# Altium project MDES_V3.PrjPCB
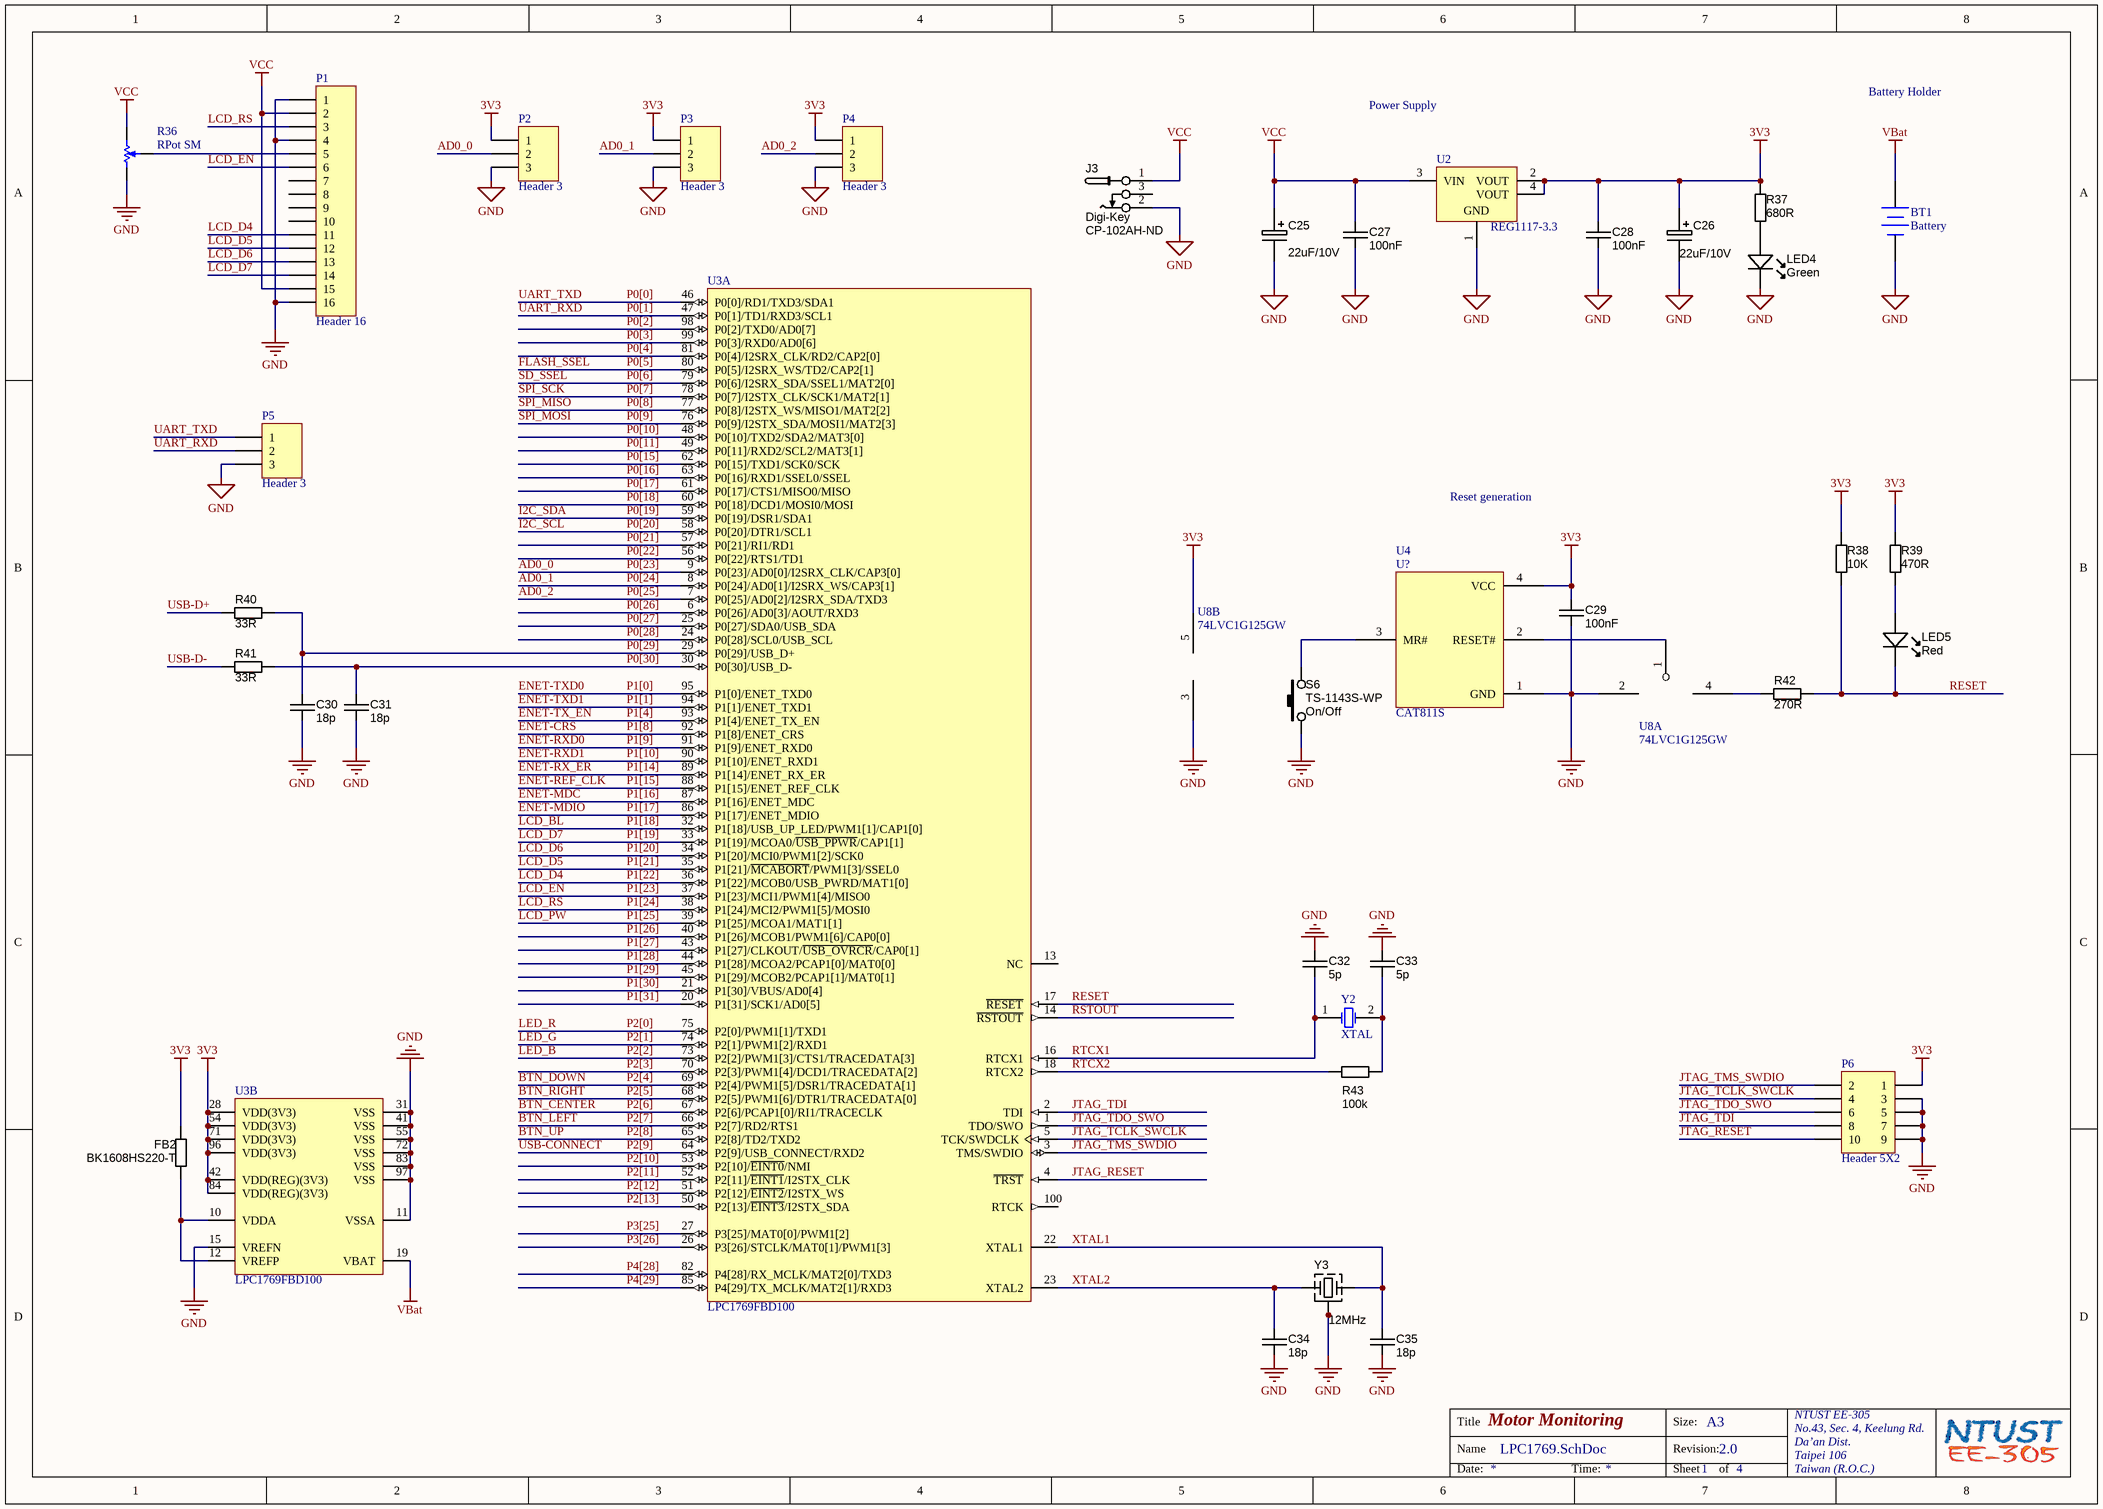
[diagram p0: LPC1769.SchDoc]
9 sheets, 227 parts. Net scope: global (net labels, ports and power ports of the same name join across sheets).
Board file: MDES_V3.PcbDoc
Sheets:
  LPC1769.SchDoc
  Ethernet.SchDoc
  Debug and Reset.SchDoc
  Power supply.SchDoc
  SPI peripherals.SchDoc
  USB.SchDoc
  Analog Input.SchDoc
  Expansion connectors.SchDoc
  Accelerometer.SchDoc

## Sheet LPC1769.SchDoc: Motor Monitoring
size A3; Organization: NTUST EE-305; Address1: No.43, Sec. 4, Keelung Rd.; Address2: Da’an Dist.; Address3: Taipei 106; Address4: Taiwan (R.O.C.); Revision: 2.0; SheetNumber: 1; SheetTotal: 4

### Parts
(Parts that share a designator on the sheet are numbered #1, #2 ... from top to bottom, then left to right.)
BT1  Battery  [BAT-2]
C25#1  (no value)  [CAP_ELEC_5x5.7]
C26#1  (no value)  [CAP_ELEC_5x5.7]
C27#1  value 100nF  [CAPC1608N]  (hidden comment: approved sub OK)
C28#1  value 100nF  [CAPC1608N]  (hidden comment: approved sub OK)
C29#1  value 100nF  [CAPC1005N]  (hidden comment: approved sub OK)
C30#1  value 18p  [CAPC1608N]  (hidden comment: approved sub OK)
C31#1  value 18p  [CAPC1608N]  (hidden comment: approved sub OK)
C32#1  value 5p  [CAPC1005N]  (hidden comment: approved sub OK)
C33#1  value 5p  [CAPC1005N]  (hidden comment: approved sub OK)
C34#1  value 18p  [CAPC1005N]  (hidden comment: approved sub OK)
C35#1  value 18p  [CAPC1005N]  (hidden comment: approved sub OK)
FB2  value BK1608HS220-T  [RESC2012N]  (hidden comment: Thick Film)
J3#1  Supplier 1: Digi-Key  Supplier Part Number 1: CP-102AH-ND  [CONN_PWR_JACK_2.1x5.5mm]  (hidden comment: CONN_PWR_JACK_2.1x5.5mm)
LED4  Green  [LED-0603-GREEN]
LED5  Red  [LED-0603-GREEN]
P1#1  Header 16  [HDR1X16]
P2#1  Header 3  [HDR1X3]
P3#1  Header 3  [HDR1X3]
P4#1  Header 3  [HDR1X3]
P5  Header 3  [HDR1X3]
P6  Header 5X2  [Header 5x2p]
R36  RPot SM  [POT4MM-2]
R37  value 680R  [RESC1005N]  (hidden comment: Thick Film)
R38  value 10K  [RESC1005N]  (hidden comment: Thick Film)
R39  value 470R  [RESC1005N]  (hidden comment: Thick Film)
R40  value 33R  [RESC1608N]  (hidden comment: Thick Film)
R41  value 33R  [RESC1608N]  (hidden comment: Thick Film)
R42  value 270R  [RESC1005N]  (hidden comment: Thick Film)
R43  value 100k  [RESC1005N]  (hidden comment: Thick Film)
S6  TS-1143S-WP  Function: On/Off  [TS-1143S]
U2#1  REG1117-3.3  [TI-DCY4_N]
U3#1  LPC1769FBD100  [SOT407-1_V]  (parts A,B of 2)
U4#1  CAT811S  [SOT-143-RC4_N]
U8#1  74LVC1G125GW  [SOT-23-CT5_N]  (parts A,B of 2)
Y2  XTAL  [HC49/4H_SMX]
Y3#1  12MHz  [CRYSTAL_4-LCC]

### Nets
3V3: C26#1.1 C28#1.2 C29#1.1 FB2.2 P2#1.1 P3#1.1 P4#1.1 P6.1 R37.2 R38.2 R39.2 U2#1.2(VOUT) U2#1.4(VOUT) U3#1.28(VDD(3V3)) U3#1.42(VDD(REG)(3V3)) U3#1.54(VDD(3V3)) U3#1.71(VDD(3V3)) U3#1.84(VDD(REG)(3V3)) U3#1.96(VDD(3V3)) U4#1.4(VCC) U8#1.5(VCC)
GND: BT1.2(-) C25#1.2 C26#1.2 C27#1.2 C28#1.1 C29#1.2 C30#1.1 C31#1.1 C32#1.2 C33#1.2 C34#1.1 C35#1.1 J3#1.2 LED4.K P1#1.1 P1#1.4 P1#1.16 P2#1.3 P3#1.3 P4#1.3 P5.3 P6.3 P6.5 P6.7 P6.9 R36.CCW(-) S6.1 U2#1.1(GND) U3#1.11(VSSA) U3#1.15(VREFN) U3#1.31(VSS) U3#1.41(VSS) U3#1.55(VSS) U3#1.72(VSS) U3#1.83(VSS) U3#1.97(VSS) U4#1.1(GND) U8#1.2(A) U8#1.3(GND) Y3#1.2(GND) Y3#1.4(GND)
VBAT: BT1.1(+) U3#1.19(VBAT)
VCC: C25#1.1 C27#1.1 J3#1.1 P1#1.2 P1#1.15 R36.CW(+) U2#1.3(VIN)
AD0_0: P2#1.2 U3#1.9(P0[23]/AD0[0]/I2SRX_CLK/CAP3[0])  [also labelled P0[23]]
AD0_1: P3#1.2 U3#1.8(P0[24]/AD0[1]/I2SRX_WS/CAP3[1])  [also labelled P0[24]]
AD0_2: P4#1.2 U3#1.7(P0[25]/AD0[2]/I2SRX_SDA/TXD3)  [also labelled P0[25]]
BTN_CENTER: U3#1.67(P2[6]/PCAP1[0]/RI1/TRACECLK)  [also labelled P2[6]]
BTN_DOWN: U3#1.69(P2[4]/PWM1[5]/DSR1/TRACEDATA[1])  [also labelled P2[4]]
BTN_LEFT: U3#1.66(P2[7]/RD2/RTS1)  [also labelled P2[7]]
BTN_RIGHT: U3#1.68(P2[5]/PWM1[6]/DTR1/TRACEDATA[0])  [also labelled P2[5]]
BTN_UP: U3#1.65(P2[8]/TD2/TXD2)  [also labelled P2[8]]
ENET-CRS: U3#1.92(P1[8]/ENET_CRS)  [also labelled P1[8]]
ENET-MDC: U3#1.87(P1[16]/ENET_MDC)  [also labelled P1[16]]
ENET-MDIO: U3#1.86(P1[17]/ENET_MDIO)  [also labelled P1[17]]
ENET-REF_CLK: U3#1.88(P1[15]/ENET_REF_CLK)  [also labelled P1[15]]
ENET-RX_ER: U3#1.89(P1[14]/ENET_RX_ER)  [also labelled P1[14]]
ENET-RXD0: U3#1.91(P1[9]/ENET_RXD0)  [also labelled P1[9]]
ENET-RXD1: U3#1.90(P1[10]/ENET_RXD1)  [also labelled P1[10]]
ENET-TX_EN: U3#1.93(P1[4]/ENET_TX_EN)  [also labelled P1[4]]
ENET-TXD0: U3#1.95(P1[0]/ENET_TXD0)  [also labelled P1[0]]
ENET-TXD1: U3#1.94(P1[1]/ENET_TXD1)  [also labelled P1[1]]
FLASH_SSEL: U3#1.80(P0[5]/I2SRX_WS/TD2/CAP2[1])  [also labelled P0[5]]
I2C_SCL: U3#1.58(P0[20]/DTR1/SCL1)  [also labelled P0[20]]
I2C_SDA: U3#1.59(P0[19]/DSR1/SDA1)  [also labelled P0[19]]
JTAG_RESET: P6.10 U3#1.4(~{TRST})
JTAG_TCLK_SWCLK: P6.4 U3#1.5(TCK/SWDCLK)
JTAG_TDI: P6.8 U3#1.2(TDI)
JTAG_TDO_SWO: P6.6 U3#1.1(TDO/SWO)
JTAG_TMS_SWDIO: P6.2 U3#1.3(TMS/SWDIO)
LCD_BL: U3#1.32(P1[18]/USB_UP_LED/PWM1[1]/CAP1[0])  [also labelled P1[18]]
LCD_D4: P1#1.11 U3#1.36(P1[22]/MCOB0/USB_PWRD/MAT1[0])  [also labelled P1[22]]
LCD_D5: P1#1.12 U3#1.35(P1[21]/~{MCABORT}/PWM1[3]/SSEL0)  [also labelled P1[21]]
LCD_D6: P1#1.13 U3#1.34(P1[20]/MCI0/PWM1[2]/SCK0)  [also labelled P1[20]]
LCD_D7: P1#1.14 U3#1.33(P1[19]/MCOA0/~{USB_PPWR}/CAP1[1])  [also labelled P1[19]]
LCD_EN: P1#1.6 U3#1.37(P1[23]/MCI1/PWM1[4]/MISO0)  [also labelled P1[23]]
LCD_PW: U3#1.39(P1[25]/MCOA1/MAT1[1])  [also labelled P1[25]]
LCD_RS: P1#1.3 U3#1.38(P1[24]/MCI2/PWM1[5]/MOSI0)  [also labelled P1[24]]
LED_B: U3#1.73(P2[2]/PWM1[3]/CTS1/TRACEDATA[3])  [also labelled P2[2]]
LED_G: U3#1.74(P2[1]/PWM1[2]/RXD1)  [also labelled P2[1]]
LED_R: U3#1.75(P2[0]/PWM1[1]/TXD1)  [also labelled P2[0]]
P0[0]: P5.1 U3#1.46(P0[0]/RD1/TXD3/SDA1)  [also labelled UART_TXD]
P0[1]: P5.2 U3#1.47(P0[1]/TD1/RXD3/SCL1)  [also labelled UART_RXD]
P0[2]: U3#1.98(P0[2]/TXD0/AD0[7])
P0[3]: U3#1.99(P0[3]/RXD0/AD0[6])
P0[4]: U3#1.81(P0[4]/I2SRX_CLK/RD2/CAP2[0])
P0[6]: U3#1.79(P0[6]/I2SRX_SDA/SSEL1/MAT2[0])  [also labelled SD_SSEL]
P0[7]: U3#1.78(P0[7]/I2STX_CLK/SCK1/MAT2[1])  [also labelled SPI_SCK]
P0[8]: U3#1.77(P0[8]/I2STX_WS/MISO1/MAT2[2])  [also labelled SPI_MISO]
P0[9]: U3#1.76(P0[9]/I2STX_SDA/MOSI1/MAT2[3])  [also labelled SPI_MOSI]
P0[10]: U3#1.48(P0[10]/TXD2/SDA2/MAT3[0])
P0[11]: U3#1.49(P0[11]/RXD2/SCL2/MAT3[1])
P0[15]: U3#1.62(P0[15]/TXD1/SCK0/SCK)
P0[16]: U3#1.63(P0[16]/RXD1/SSEL0/SSEL)
P0[17]: U3#1.61(P0[17]/CTS1/MISO0/MISO)
P0[18]: U3#1.60(P0[18]/DCD1/MOSI0/MOSI)
P0[21]: U3#1.57(P0[21]/RI1/RD1)
P0[22]: U3#1.56(P0[22]/RTS1/TD1)
P0[26]: U3#1.6(P0[26]/AD0[3]/AOUT/RXD3)
P0[27]: U3#1.25(P0[27]/SDA0/USB_SDA)
P0[28]: U3#1.24(P0[28]/SCL0/USB_SCL)
P0[29]: C30#1.2 R40.1 U3#1.29(P0[29]/USB_D+)
P0[30]: C31#1.2 R41.1 U3#1.30(P0[30]/USB_D-)
P1[26]: U3#1.40(P1[26]/MCOB1/PWM1[6]/CAP0[0])
P1[27]: U3#1.43(P1[27]/CLKOUT/~{USB_OVRCR}/CAP0[1])
P1[28]: U3#1.44(P1[28]/MCOA2/PCAP1[0]/MAT0[0])
P1[29]: U3#1.45(P1[29]/MCOB2/PCAP1[1]/MAT0[1])
P1[30]: U3#1.21(P1[30]/VBUS/AD0[4])
P1[31]: U3#1.20(P1[31]/SCK1/AD0[5])
P2[3]: U3#1.70(P2[3]/PWM1[4]/DCD1/TRACEDATA[2])
P2[9]: U3#1.64(P2[9]/USB_CONNECT/RXD2)  [also labelled USB-CONNECT]
P2[10]: U3#1.53(P2[10]/~{EINT0}/NMI)
P2[11]: U3#1.52(P2[11]/~{EINT1}/I2STX_CLK)
P2[12]: U3#1.51(P2[12]/~{EINT2}/I2STX_WS)
P2[13]: U3#1.50(P2[13]/~{EINT3}/I2STX_SDA)
P3[25]: U3#1.27(P3[25]/MAT0[0]/PWM1[2])
P3[26]: U3#1.26(P3[26]/STCLK/MAT0[1]/PWM1[3])
P4[28]: U3#1.82(P4[28]/RX_MCLK/MAT2[0]/TXD3)
P4[29]: U3#1.85(P4[29]/TX_MCLK/MAT2[1]/RXD3)
RESET: LED5.K R38.1 R42.1 U3#1.17(~{RESET})
RSTOUT: U3#1.14(~{RSTOUT})
RTCX1: C32#1.1 U3#1.16(RTCX1) Y2.1(OSC1)
RTCX2: R43.2 U3#1.18(RTCX2)
USB-D+: R40.2
USB-D-: R41.2
XTAL1: C35#1.2 U3#1.22(XTAL1) Y3#1.3(X)
XTAL2: C34#1.2 U3#1.23(XTAL2) Y3#1.1(X)
NetC33#1_1: C33#1.1 R43.1 Y2.2(OSC2)
NetFB2_1: FB2.1 U3#1.10(VDDA) U3#1.12(VREFP)
NetLED4_A: LED4.A R37.1
NetLED5_A: LED5.A R39.1
NetP1#1_5: P1#1.5 R36.W
NetR42_2: R42.2 U8#1.4(Y)
NetS6_2: S6.2 U4#1.3(MR#)
NetU4#1_2: U4#1.2(RESET#) U8#1.1(~{OE})

Not connected (* = marked no-connect by the designer): J3#1 3; P1#1 7 8 9 10; U3#1 13(NC) 100(RTCK)

### Notes on the sheet
- Power Supply
- Battery Holder
- Reset generation
- Title
- Name
- Size:
- Revision:
- A3
- Date:
- Time:
- Sheet
- of
- (in symbol CAPT_100u_1210_6V3) 22uF/10V
- (in symbol CAT811S) U?

### Library data of the parts
BT1 = Battery: Multicell Battery; Published: 24-Mar-1999; LatestRevisionDate: 17-Jul-2002; LatestRevisionNote: Re-released for DXP Platform.; PackageReference: BAT-2; Publisher: Altium Limited; PackageDescription: Battery; 2 Leads
C25#1 C26#1 = CAPT_100u_1210_6V3: Capacitor SMD Tantalum 100uF 20% 6.3V 1210; Manufacturer 1: AVX Corporation; Manufacturer Part Number 1: TCJB107M006R0045; Tolerance: ?0%; Package / Case: 1210 (3528 Metric); Material: Tantalum; Supplier 1: Digi-Key; Supplier Part Number 1: 478-4711-1-ND
C27#1 C28#1 C29#1 C30#1 C31#1 C32#1 C33#1 C34#1 C35#1 = CAPC_100n_0805: Capacitor SMD Cer 100nF 10% 50V X7R 0805; Manufacturer 1: Kemet; Manufacturer Part Number 1: C0805C104K5RACTU; Tolerance: ?0%; Ratings: 50V; X7R; Material: ceramic; Package / Case: 0805 (2012 metric); Supplier 1: Digi-Key; Supplier Part Number 1: 399-1170-1-ND
FB2 R38 R40 R41 R43 = RES_10K_0805_5%: Resistor SMD chip 10k Ohm 0.125W 5% 0805; Manufacturer 1: Yageo; Manufacturer Part Number 1: RC0805JR-0710KL; Ratings: 1/8 W; Tolerance: ?%; Package / Case: 0805 (2012 metric); Material: Thick Film; Supplier 1: Digi-Key; Supplier Part Number 1: 311-10KARCT-ND
J3#1 = CONN_PWR_JACK_2.1x5.5mm: Power Connector, THT, 2.1mm ID, 5.5mm OD; Manufacturer 1: CUI Inc; Manufacturer Part Number 1: PJ-102AH; Category: Connectors; Mounting Type: Through Hole; Package / Case: PCB mount; Value: 2.1mm ID, 5.5mm OD
LED4 = LED_SMD_Green_0805_8mcd: LED, 0805 SMD, Green; Manufacturer 1: Ligitek; Manufacturer Part Number 1: LG-170PG-CT; Material: GaP; Ratings: 8 mcd; 558 nm; Package / Case: 0805
LED5 = LED_SMD_Red_0805: LED, 0805 SMD, Red; Manufacturer 1: Ligitek; Manufacturer Part Number 1: LG170SR-CT; Material: GaAIAs; Ratings: 20 mcd; 643 nm; Package / Case: 0805
P1#1 = Header 16: Header, 16-Pin; LatestRevisionDate: 17-Jul-2002; LatestRevisionNote: Re-released for DXP Platform.; Publisher: Altium Limited
P2#1 P3#1 P4#1 P5 = Header 3: Header, 3-Pin; LatestRevisionDate: 17-Jul-2002; LatestRevisionNote: Re-released for DXP Platform.; Publisher: Altium Limited
P6 = Header 5X2: Header, 5-Pin, Dual row; LatestRevisionDate: 17-Jul-2002; LatestRevisionNote: Re-released for DXP Platform.; Publisher: Altium Limited
R36 = RPot SM: Square Trimming Potentiometer; Published: 17-Dec-2003; DatasheetVersion: Oct-2003; PackageReference: POT4MM-2; Publisher: Altium Limited; PackageDescription: Square Trimming Potentiometer; ComponentLink1Description: Manufacturer Link; ComponentLink1URL: http://bourns.com/2/search.html
R37 R42 = RES_330R_0402_5%: Resistor SMD chip 330 Ohm 0.063W 5% 0402; Manufacturer 1: Yageo; Manufacturer Part Number 1: RC0402JR-07330RL; Ratings: 1/16 W; Tolerance: ?%; Package / Case: 0402 (1005 Metric); Supplier 1: Digi-Key; Supplier Part Number 1: 311-330JRCT-ND; ComponentLink1URL: http://www.yageo.com/documents/recent/PYu-RC0402_51_RoHS_L_6.pdf; ComponentLink1Description: http://www.yageo.com/documents/recent/PYu-RC0402_51_RoHS_L_6.pdf
R39 = RES_470R_0603_5%: Resistor SMD chip 470 Ohm 0.1W 5% 0603; Manufacturer 1: Vishay/Dale; Manufacturer Part Number 1: CRCW0603470RJNEA; Ratings: 1/10 W; Tolerance: ?%; Package / Case: 0603 (1608 metric); Material: Thick Film; Supplier 1: Digi-Key; Supplier Part Number 1: 541-470GCT-ND
S6 = SW_SMD_PB_4.3mm: Switch SMD Tact 4.3mm Stem; Manufacturer 1: Bond-Tact; Manufacturer Part Number 1: TS-1143S-WP-200; Package / Case: 6.5x6.5mm; 4.3mm stem
U2#1 = REG1117-3.3: Single Output LDO, 800 mA, Fixed 3.3 V Output, 3.8 to 15 V Input, with Internal Current Limiting, 4-pin SOT-223 (DCY), -40 to 125 degC, Green (RoHS & no Sb/Br); Manufacturer: Texas Instruments; Fixed Output Options(V): 5; Iout(Max)(A): 0.8; Iq(Typ)(mA): 4; Rating: Catalog; SubFamily: Single Channel LDO; Vdo(Typ)(mV): 1100; Vin(Max)(V): 15; Vin(Min)(V): 3.8; Vout Adj(Max)(V): 3.3; DatasheetVersion: SBVS001D; PackageVersion: 4202506/B; PackageReference: DCY4; PackageDescription: 4-Pin Plastic Small Outline, Body 3.5 x 6.5 mm, Pitch 2.3 mm; Supplier 1: Digi-Key; Supplier Part Number 1: REG1117-3.3-ND; Supplier 2: Farnell; Supplier Part Number 2: 1212355; Supplier 3: Farnell; Supplier Part Number 3: 2126471; Supplier 4: Newark; Supplier Part Number 4: 35C1963; Supplier 5: Mouser; Supplier Part Number 5: 595-REG1117-3.3; Eco-Plan: Green (RoHS & no Sb/Br); Vout Adj(Min)(V): 3.3; Mounting Technology: Surface Mount; Code_JEDEC: TO-261; PartNumber: REG1117-3.3; ComponentLink1Description: Manufacturer URL; ComponentLink1URL: http://www.ti.com/; ComponentLink2Description: Datasheet; ComponentLink2URL: http://www.ti.com/general/docs/lit/getliterature.tsp?genericPartNumber=REG1117-33&fileType=pdf; ComponentLink3Description: Package Specification; ComponentLink3URL: http://www.ti.com/litv/pdf/mpds094a
U3#1 = LPC1769FBD100: 32-bit ARM Cortex-M3 MCU, 512 kB Flash, 64 kB SRAM, Ethernet, USB 2.0 Device/Host/OTG, 12-Bit ADC, DAC, I2S, 100-Pin LQFP; fmax: 120 MHz; SRAM: 64 kB; Flash: 512 kB; GPIOs: 70; USB: 1; CAN: 2; UART: 4; PWM: 6; PLL: Y; ADC channels: 8; VDD (min): 2.4 V; VDD (typ): 3.3 V; VDD (max): 3.6 V; Code_IEC: 136E20; DatasheetVersion: Rev. 8, Nov-2011; PackageVersion: Feb-2003; PackageReference: SOT407-1; PackageDescription: LQFP100: Plastic Low Profile Quad Flat Package; 100 Leads; Body 14 x 14 x 1.4 mm; SPI: 1; SSP: 2; Timers: 4; Code_JEDEC: MS-026; PartNumber: LPC1769FBD100; ComponentLink1Description: Manufacturer URL; ComponentLink1URL: http://www.nxp.com/; ComponentLink2Description: Datasheet; ComponentLink2URL: http://www.nxp.com/documents/data_sheet/LPC1769_68_67_66_65_64_63.pdf
Y2 = XTAL: Crystal Oscillator; Published: 8-Jun-2000; LatestRevisionDate: 17-Jul-2002; LatestRevisionNote: Re-released for DXP Platform.; PackageReference: R38; Publisher: Altium Limited; PackageDescription: Crystal, Thru-Hole; 2 Leads; Body 3.1 x 8.2 mm (Dia.xH)
Y3#1 = CRYSTAL_27M12: Oscillator Crystal 27.12 MHz 10ppm; Manufacturer 1: TXC CORPORATION; Manufacturer Part Number 1: 7M-27.120MEEQ-T; Ratings: 4.9152 MHz Crystal; Frequency Stability: ?0ppm; Load Capacitance: 10pF; Operating Mode: Fundamental; Package / Case: 2.5mm pitch; Material: Ceramic; Supplier 1: Digi-Key; Supplier Part Number 1: 887-1329-1-ND; Type: MHz Crystal; Frequency Tolerance: ?0ppm; Operating Temperature: -20蚓 ~ 70蚓; Mounting Type: Surface Mount; Size / Dimension: 0.126" L x 0.098" W (3.20mm x 2.50mm); ComponentLink1URL: http://www.txccrystal.com/images/pdf/7m-accuracy.pdf; ComponentLink1Description: http://www.txccrystal.com/images/pdf/7m-accuracy.pdf

## Sheet Ethernet.SchDoc: Motor Vibration
size A4; Organization: NTUST EE-305; Address1: No.43, Sec. 4, Keelung Rd.; Address2: Da’an Dist.; Address3: Taipei 106; Address4: Taiwan (R.O.C.); DocumentNumber: 1; Revision: 3.0; SheetNumber: 2; SheetTotal: 9
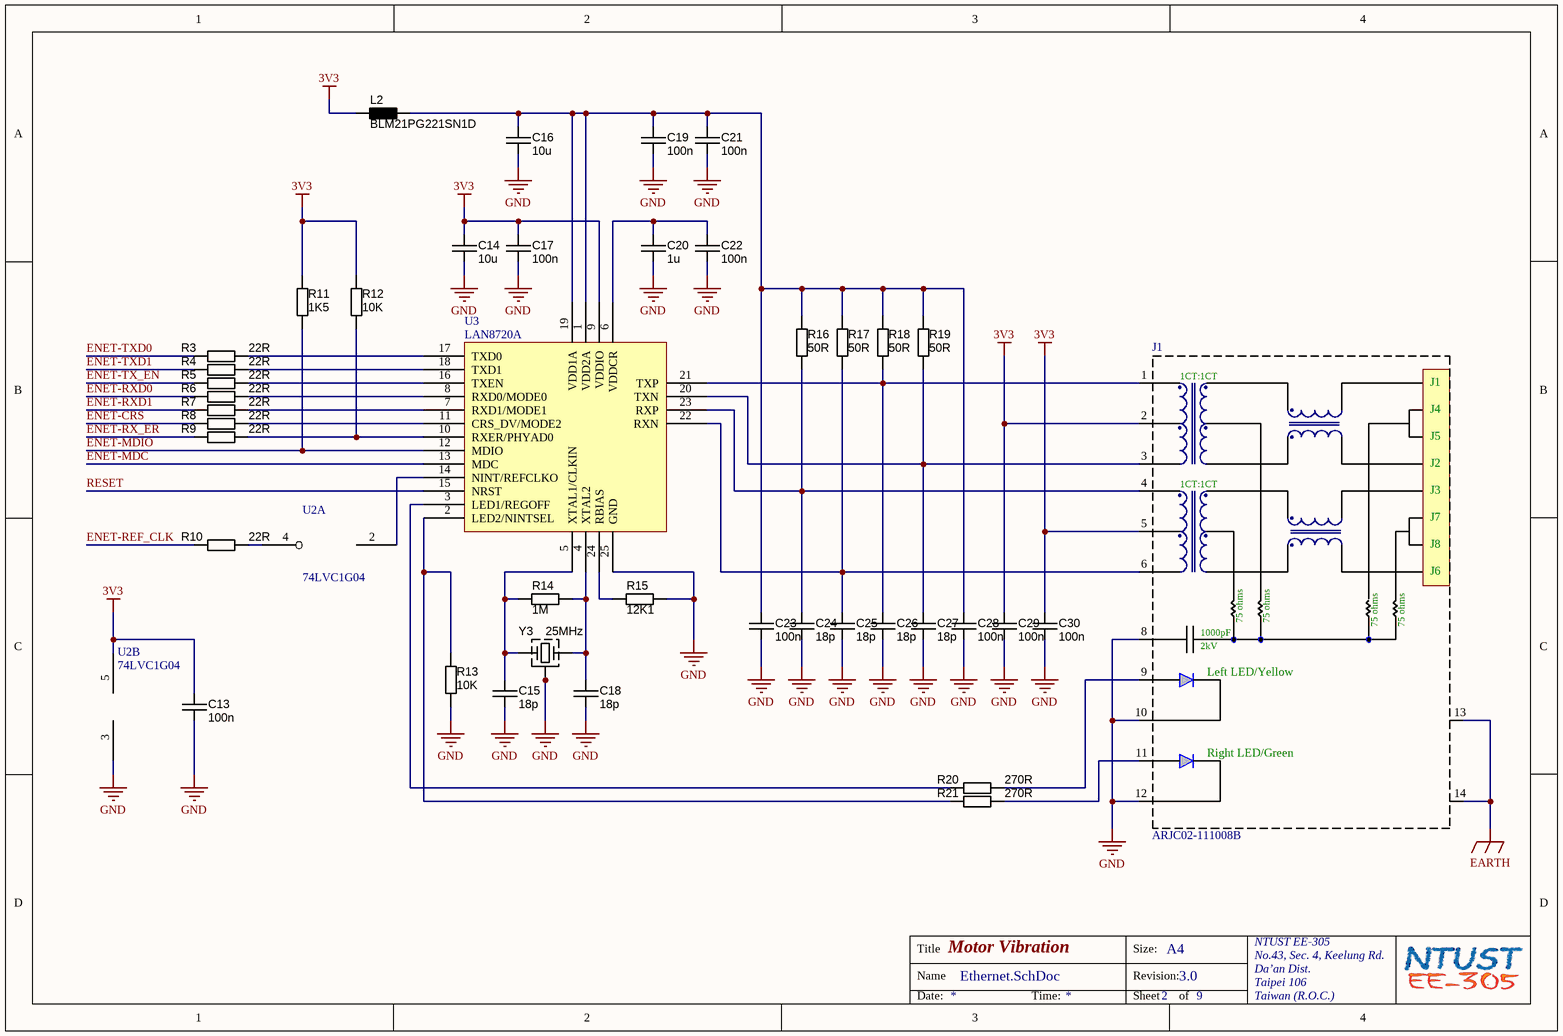
[diagram p1: Ethernet.SchDoc]

### Parts
(Parts that share a designator on the sheet are numbered #1, #2 ... from top to bottom, then left to right.)
C13  100n  [CAPC1005N]
C14  10u  [CAPC2012N]
C15  18p  [CAPC1005N]
C16  10u  [CAPC2012N]
C17  100n  [CAPC1005N]
C18  18p  [CAPC1005N]
C19  100n  [CAPC1005N]
C20  1u  [CAPC1608N]
C21  100n  [CAPC1005N]
C22  100n  [CAPC1005N]
C23  100n  [CAPC1005N]
C24  18p  [CAPC1005N]
C25#2  18p  [CAPC1005N]
C26#2  18p  [CAPC1005N]
C27#2  18p  [CAPC1005N]
C28#2  100n  [CAPC1005N]
C29#2  100n  [CAPC1005N]
C30#2  100n  [CAPC1005N]
J1  ARJC02-111008B  [ARJC02-111008B]
L2  BLM21PG221SN1D  [INDC2012N]
R3  22R  [RESC1005N]
R4  22R  [RESC1005N]
R5  22R  [RESC1005N]
R6  22R  [RESC1005N]
R7  22R  [RESC1005N]
R8  22R  [RESC1005N]
R9  22R  [RESC1005N]
R10  22R  [RESC1005N]
R11  1K5  [RESC1005N]
R12  10K  [RESC1005N]
R13  10K  [RESC1005N]
R14  1M  [RESC1005N]
R15  12K1  [RESC1005N]
R16  50R  [RESC1005N]
R17  50R  [RESC1005N]
R18  50R  [RESC1005N]
R19  50R  [RESC1005N]
R20  270R  [RESC1005N]
R21  270R  [RESC1005N]
U2#2  74LVC1G04  [SC70-LT5_N]  (parts A,B of 2)
U3#2  LAN8720A  [QFN-MJ24]
Y3#2  25MHz  [4SMD]

### Nets
3V3: C13.1 C14.1 C17.1 C29#2.1 C30#2.1 J1.2(CTD) J1.5(CRD) L2.1 R11.1 R12.1 U2#2.5(VCC) U3#2.9(VDDIO)
EARTH: J1.13(GND) J1.14(GND)
GND: C13.2 C14.2 C15.2 C16.2 C17.2 C18.2 C19.2 C20.2 C21.2 C22.2 C23.2 C24.2 C25#2.2 C26#2.2 C27#2.2 C28#2.2 C29#2.2 C30#2.2 J1.8(Shield) J1.10 J1.12 R13.2 R15.2 U2#2.3(GND) U3#2.25(GND) Y3#2.2(GND) Y3#2.4(GND)
ENET-CRS: R8.1
ENET-MDC: U3#2.13(MDC)
ENET-MDIO: R11.2 U3#2.12(MDIO)
ENET-REF_CLK: R10.1
ENET-RX_ER: R9.1
ENET-RXD0: R6.1
ENET-RXD1: R7.1
ENET-TX_EN: R5.1
ENET-TXD0: R3.1
ENET-TXD1: R4.1
RESET: U3#2.15(NRST)
NetC15_1: C15.1 R14.1 U3#2.5(XTAL1/CLKIN) Y3#2.1(X)
NetC16_1: C16.1 C19.1 C21.1 C23.1 C28#2.1 L2.2 R16.1 R17.1 R18.1 R19.1 U3#2.1(VDD2A) U3#2.19(VDD1A)
NetC18_1: C18.1 R14.2 U3#2.4(XTAL2) Y3#2.3(X)
NetC20_1: C20.1 C22.1 U3#2.6(VDDCR)
NetC24_1: C24.1 J1.4(RD+) R16.2 U3#2.23(RXP)
NetC25#2_1: C25#2.1 J1.6(RD-) R17.2 U3#2.22(RXN)
NetC26#2_1: C26#2.1 J1.1(TD+) R18.2 U3#2.21(TXP)
NetC27#2_1: C27#2.1 J1.3(TD-) R19.2 U3#2.20(TXN)
NetJ1_9: J1.9 R20.2
NetJ1_11: J1.11 R21.2
NetR3_2: R3.2 U3#2.17(TXD0)
NetR4_2: R4.2 U3#2.18(TXD1)
NetR5_2: R5.2 U3#2.16(TXEN)
NetR6_2: R6.2 U3#2.8(RXD0/MODE0)
NetR7_2: R7.2 U3#2.7(RXD1/MODE1)
NetR8_2: R8.2 U3#2.11(CRS_DV/MODE2)
NetR9_2: R9.2 R12.2 U3#2.10(RXER/PHYAD0)
NetR10_2: R10.2 U2#2.4
NetR13_1: R13.1 R21.1 U3#2.2(LED2/NINTSEL)
NetR15_1: R15.1 U3#2.24(RBIAS)
NetR20_1: R20.1 U3#2.3(LED1/REGOFF)
NetU2#2_2: U2#2.2 U3#2.14(NINT/REFCLKO)

### Notes on the sheet
- Title
- Name
- Size:
- Revision:
- A4
- Date:
- Time:
- Sheet
- of
- (in symbol ARJC02-111008B) 1CT:1CT; J4; J5; J2; J3; J7; J8; J6; 75 ohms; 1000pF; 2kV; Left LED/Yellow; Right LED/Green

### Library data of the parts
C13 C14 C16 C17 C19-C23 C28#2 C29#2 C30#2 = Capacitor SMD Cer X7R: Manufacturer 1: Kemet; Manufacturer Part Number 1: C0805C104K5RACTU; Tolerance: ?0%; Ratings: 50V; X7R; Material: ceramic; Package / Case: 0805 (2012 metric); Supplier 1: Digi-Key; Supplier Part Number 1: 399-1170-1-ND
  C13 C17 C19 C21-C23 C28#2 C29#2 C30#2: Value: 100n
  C14 C16: Value: 10u
  C20: Value: 1u
C15 C18 C24 C25#2 C26#2 C27#2 = Capacitor SMD Cer NPO: Manufacturer 1: Kemet; Manufacturer Part Number 1: C0805C104K5RACTU; Tolerance: ?0%; Ratings: 50V; X7R; Material: ceramic; Package / Case: 0805 (2012 metric); Supplier 1: Digi-Key; Supplier Part Number 1: 399-1170-1-ND; Value: 18p
J1 = ARJC02-111008B: 1 Port RJ45 Magjack Connector Through Hole 10/100 Base-TX, AutoMDIX; Supplier 1: Digi-Key; Supplier Part Number 1: 535-12605-ND
L2 = BLM21PG221SN1D: EMIFILr (Inductor type) Chip Ferrite Bead; Supplier 1: Digi-Key; Supplier Part Number 1: 490-1054-1-ND
R3-R21 = Resistor SMD chip: Manufacturer 1: Yageo; Manufacturer Part Number 1: RC0805JR-0710KL; Ratings: 1/8 W; Tolerance: ?%; Package / Case: 0805 (2012 metric); Material: Thick Film; Supplier 1: Digi-Key; Supplier Part Number 1: 311-10KARCT-ND
  R3-R10: Value: 22R
  R11: Value: 1K5
  R12 R13: Value: 10K
  R14: Value: 1M
  R15: Value: 12K1
  R16-R19: Value: 50R
  R20 R21: Value: 270R
U3#2 = Microchip LAN8720A: Small Footprint RMII 10/100 Ethernet  Transceiver with HP Auto-MDIX Support; Supplier 1: Digi-Key; Supplier Part Number 1: LAN8720A-CP-CT-ND
Y3#2 = CRYSTAL 25M: Oscillator Crystal; Supplier 1: Digi-Key; Supplier Part Number 1: 887-1099-1-ND

## Sheet Debug and Reset.SchDoc: Motor Vibration
size A4; Organization: NTUST EE-305; Address1: No.43, Sec. 4, Keelung Rd.; Address2: Da’an Dist.; Address3: Taipei 106; Address4: Taiwan (R.O.C.); DocumentNumber: 1; Revision: 3.0; SheetNumber: 3; SheetTotal: 9
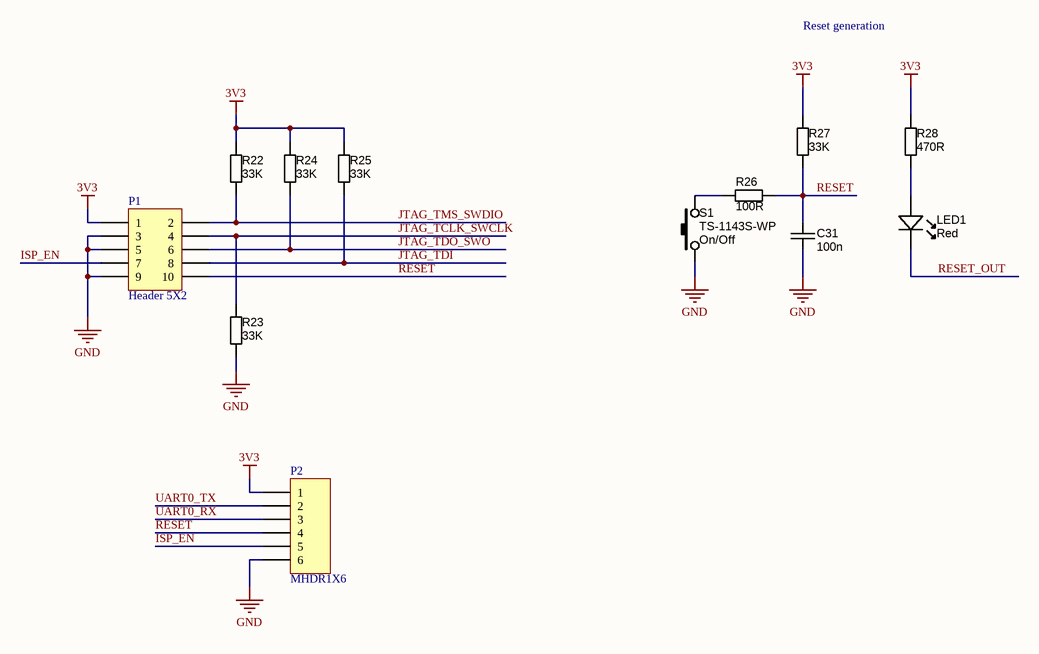
[diagram p2: Debug and Reset.SchDoc]

### Parts
(Parts that share a designator on the sheet are numbered #1, #2 ... from top to bottom, then left to right.)
C31#2  100n  [CAPC1005N]
LED1  Red  [LED-0603-RED]
P1#2  Header 5X2  [Header 5x2 1.27mm]
P2#2  MHDR1X6  [MHDR1X6]
R22  33K  [RESC1005N]
R23  33K  [RESC1005N]
R24  33K  [RESC1005N]
R25  33K  [RESC1005N]
R26  100R  [RESC1005N]
R27  33K  [RESC1005N]
R28  470R  [RESC1005N]
S1  TS-1143S-WP  Function: On/Off  [TS-1143S]

### Nets
3V3: P1#2.1 P2#2.1 R22.1 R24.1 R25.1 R27.1 R28.1
GND: C31#2.2 P1#2.3 P1#2.5 P1#2.9 P2#2.6 R23.2 S1.1
ISP_EN: P1#2.7 P2#2.5
JTAG_TCLK_SWCLK: P1#2.4 R23.1
JTAG_TDI: P1#2.8 R25.2
JTAG_TDO_SWO: P1#2.6 R24.2
JTAG_TMS_SWDIO: P1#2.2 R22.2
RESET: C31#2.1 P1#2.10 P2#2.4 R26.2 R27.2
RESET_OUT: LED1.K
UART0_RX: P2#2.3
UART0_TX: P2#2.2
NetLED1_A: LED1.A R28.2
NetR26_1: R26.1 S1.2

### Notes on the sheet
- Reset generation
- Title
- Name
- Size:
- Revision:
- A4
- Date:
- Time:
- Sheet
- of

### Library data of the parts
C31#2 = Capacitor SMD Cer X7R: as C13 on sheet Ethernet; Package / Case: 0805 (2012 metric); Supplier 1: Digi-Key; Supplier Part Number 1: 399-1170-1-ND; Value: 100n
LED1 = LED_SMD_Red_0805: as LED5 on sheet LPC1769; Package / Case: 0805
P1#2 = Header 5X2: Header, 5-Pin, Dual row; LatestRevisionDate: 17-Jul-2002; LatestRevisionNote: Re-released for DXP Platform.; Publisher: Altium Limited
P2#2 = MHDR1X6: Header, 6-Pin; LatestRevisionDate: 17-Jul-2002; LatestRevisionNote: Re-released for DXP Platform.; Publisher: Altium Limited
R22-R28 = Resistor SMD chip: as R3 on sheet Ethernet; Package / Case: 0805 (2012 metric); Material: Thick Film; Supplier 1: Digi-Key; Supplier Part Number 1: 311-10KARCT-ND
  R22-R25 R27: Value: 33K
  R26: Value: 100R
  R28: Value: 470R
S1 = SW_SMD_PB_4.3mm: as S6 on sheet LPC1769; Package / Case: 6.5x6.5mm; 4.3mm stem

## Sheet Power supply.SchDoc: Motor Vibration
size A4; Organization: NTUST EE-305; Address1: No.43, Sec. 4, Keelung Rd.; Address2: Da’an Dist.; Address3: Taipei 106; Address4: Taiwan (R.O.C.); DocumentNumber: 1; Revision: 3.0; SheetNumber: 4; SheetTotal: 9
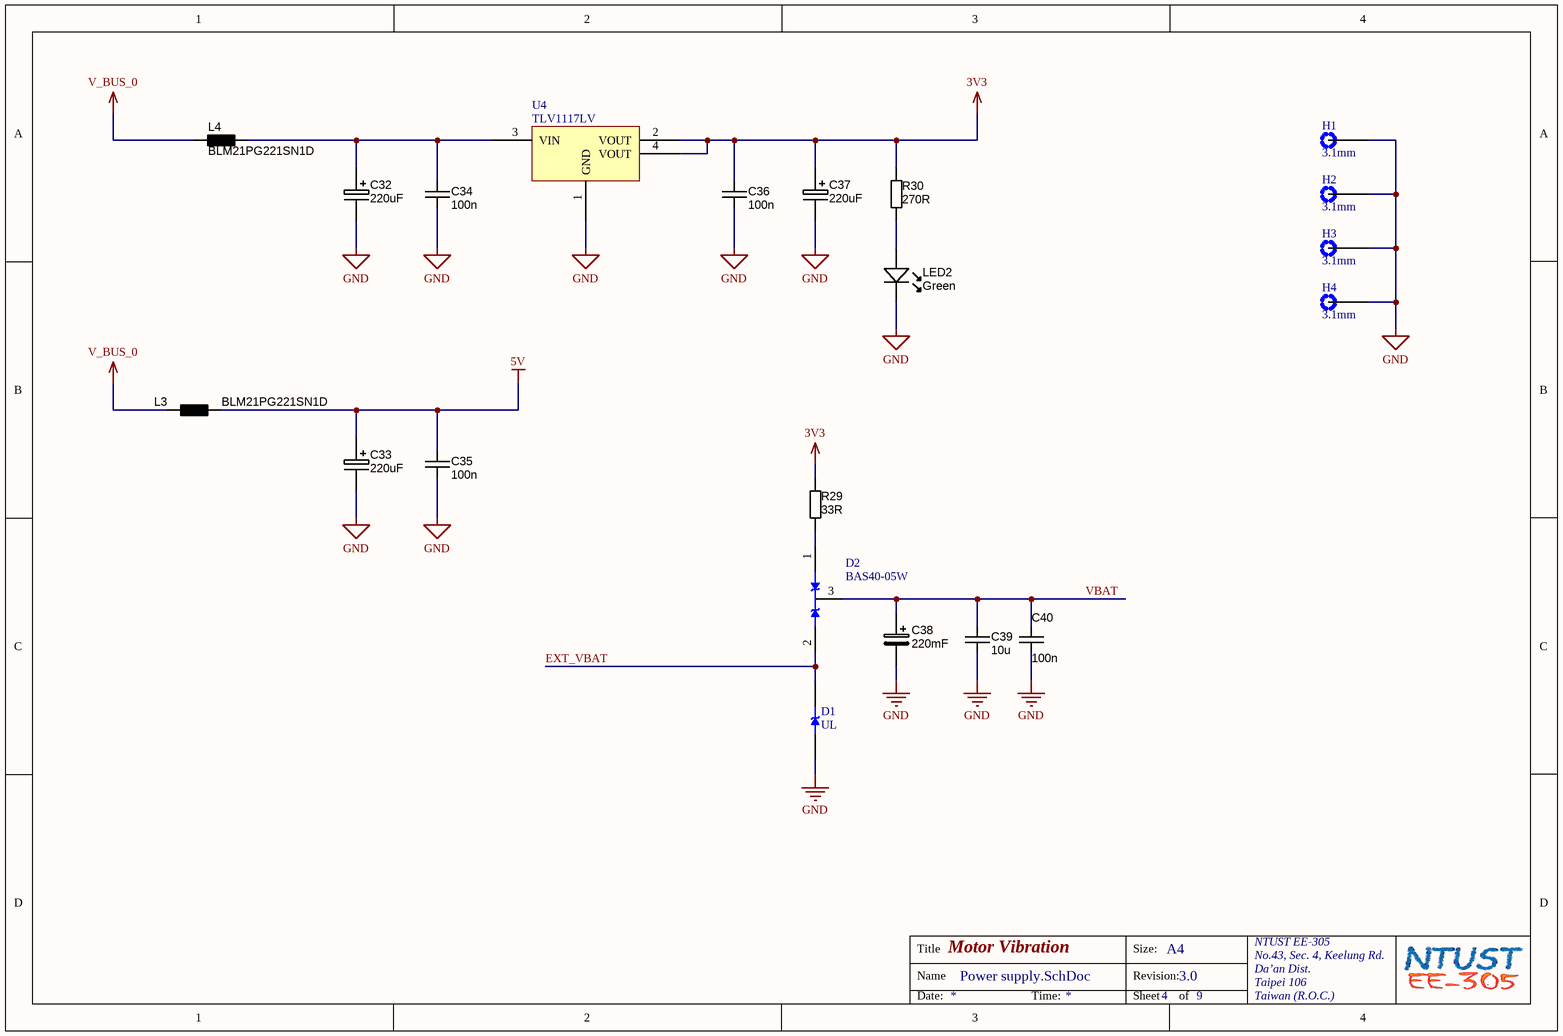
[diagram p3: Power supply.SchDoc]

### Parts
(Parts that share a designator on the sheet are numbered #1, #2 ... from top to bottom, then left to right.)
C32#2  220uF  [CAP_ELEC_SIZE_D8]
C33#2  220uF  [CAP_ELEC_SIZE_D8]
C34#2  100n  [CAPC1005N]
C35#2  100n  [CAPC1005N]
C36#1  100n  [CAPC1005N]
C37#1  220uF  [CAP_ELEC_SIZE_D8]
C38#1  220mF  [CAPC3225N]
C39#1  10u  [CAPC1005N]
C40  100n  [CAPC1005N]
D1  UL  [SOD323]
D2  BAS40-05W  [SOT323(SC70)]
H1  3.1mm  [Holes]
H2  3.1mm  [Holes]
H3  3.1mm  [Holes]
H4  3.1mm  [Holes]
L3  BLM21PG221SN1D  [INDC2012N]
L4  BLM21PG221SN1D  [INDC2012N]
LED2  Green  [LED-0603-GREEN]
R29  33R  [RESC1005N]
R30  270R  [RESC1005N]
U4#2  TLV1117LV  [SOT-223-DB3_N]

### Nets
3V3: C36#1.1 C37#1.1 R29.1 R30.1 U4#2.2(VOUT) U4#2.4(VOUT)
5V: C33#2.1 C35#2.1 L3.2
GND: C32#2.2 C33#2.2 C34#2.2 C35#2.2 C36#1.2 C37#1.2 C38#1.2 C39#1.2 C40.2 D1.2(anode) H1.0 H2.0 H3.0 H4.0 LED2.K U4#2.1(GND)
V_BUS_0: L3.1 L4.1
VBAT: C38#1.1 C39#1.1 C40.1 D2.3
EXT_VBAT: D1.1(cathode) D2.2
NetC32#2_1: C32#2.1 C34#2.1 L4.2 U4#2.3(VIN)
NetD2_1: D2.1 R29.2
NetLED2_A: LED2.A R30.2

### Notes on the sheet
- Title
- Name
- Size:
- Revision:
- A4
- Date:
- Time:
- Sheet
- of

### Library data of the parts
C32#2 C33#2 C37#1 = Capacitor SMD Alum Elec: Ratings: 10V; 105蚓; Tolerance: ?0%; Material: Al; Package / Case: Radial - Surface Mount; Supplier 1: Digi-Key; Supplier Part Number 1: PCE4185CT-ND; Value: 220uF
C34#2 C35#2 C36#1 C40 = Capacitor SMD Cer X7R: as C13 on sheet Ethernet; Package / Case: 0805 (2012 metric); Supplier 1: Digi-Key; Supplier Part Number 1: 399-1170-1-ND; Value: 100n
C38#1 = DSK-3R3H224U-HL: CAP 220MF -20% +80% 3.3V SMD; Supplier 1: Digi-Key; Supplier Part Number 1: 604-1020-1-ND; Value: 220mF
C39#1 = Capacitor SMD Cer X5R: Manufacturer 1: Kemet; Manufacturer Part Number 1: C0805C104K5RACTU; Tolerance: ?0%; Ratings: 50V; X7R; Material: ceramic; Package / Case: 0805 (2012 metric); Supplier 1: Digi-Key; Supplier Part Number 1: 399-1170-1-ND; Value: 10u
D1 = PMEG4005EJ: DIODE SCHOTTKY 40V 500MA SOD323F; Supplier 1: Digi-Key; Supplier Part Number 1: 568-4133-1-ND
D2 = BAS40 series: General-purpose Schottky diodes
H1-H4 = Holes: Mounting Holes
L3 L4 = BLM21PG221SN1D: as L2 on sheet Ethernet; Supplier 1: Digi-Key; Supplier Part Number 1: 490-1054-1-ND
LED2 = LED_SMD_Green_0805_8mcd: as LED4 on sheet LPC1769; Package / Case: 0805
R29 R30 = Resistor SMD chip: as R3 on sheet Ethernet; Package / Case: 0805 (2012 metric); Material: Thick Film; Supplier 1: Digi-Key; Supplier Part Number 1: 311-10KARCT-ND
  R29: Value: 33R
  R30: Value: 270R
U4#2 = TLV1117LV: 1-A, Positive Fixed-Voltage, Low-Dropout Regulator; Supplier 1: Digi-Key; Supplier Part Number 1: 296-28778-1-ND

## Sheet SPI peripherals.SchDoc: Motor Monitoring
size A3; Organization: NTUST EE-305; Address1: No.43, Sec. 4, Keelung Rd.; Address2: Da’an Dist.; Address3: Taipei 106; Address4: Taiwan (R.O.C.); Revision: 2.0; SheetNumber: 3; SheetTotal: 4
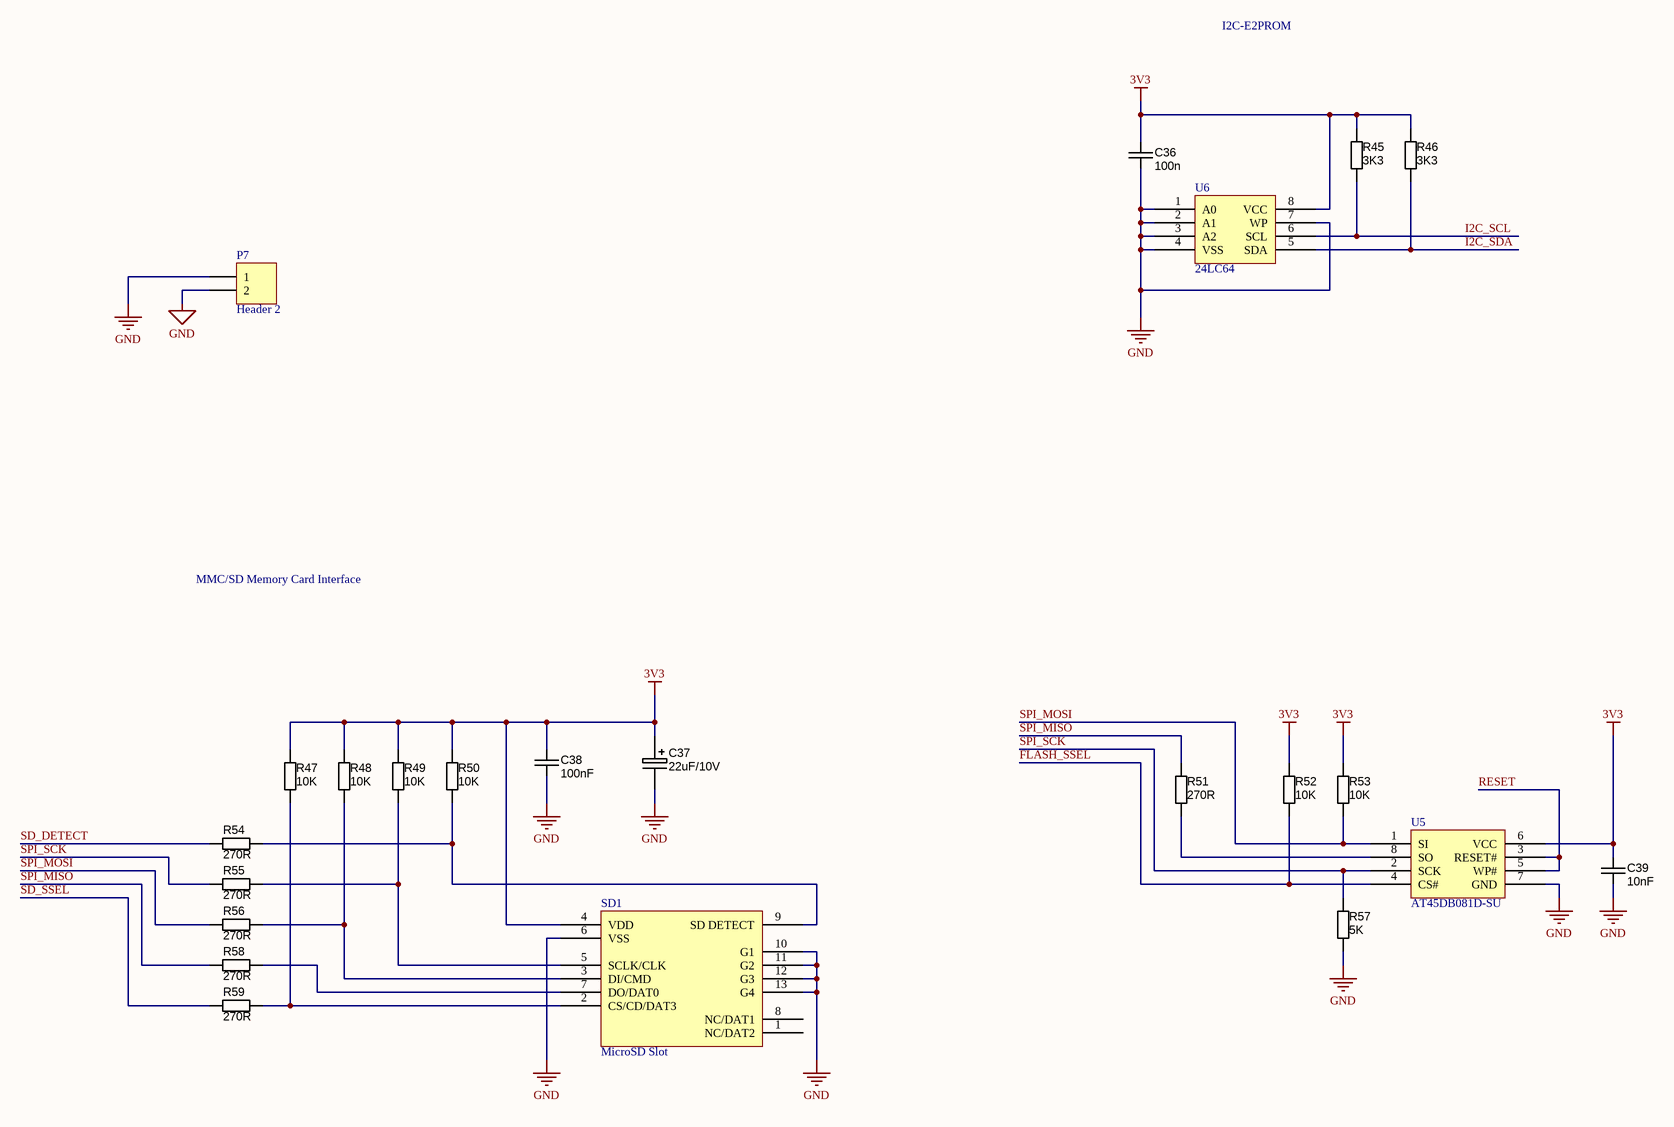
[diagram p4: SPI peripherals.SchDoc]

### Parts
(Parts that share a designator on the sheet are numbered #1, #2 ... from top to bottom, then left to right.)
C36#2  value 100n  [CAPC1608N]  (hidden comment: approved sub OK)
C37#2  Ratings: 22uF/10V  [CAPC3216N]
C38#2  value 100nF  [CAPC1608N]  (hidden comment: approved sub OK)
C39#2  value 10nF  [CAPC1608N]  (hidden comment: approved sub OK)
P7  Header 2  [HDR1X2]
R45  value 3K3  [RESC1005N]  (hidden comment: Thick Film)
R46  value 3K3  [RESC1005N]  (hidden comment: Thick Film)
R47  value 10K  [RESC1005N]  (hidden comment: Thick Film)
R48  value 10K  [RESC1005N]  (hidden comment: Thick Film)
R49  value 10K  [RESC1005N]  (hidden comment: Thick Film)
R50  value 10K  [RESC1005N]  (hidden comment: Thick Film)
R51#1  value 270R  [RESC1005N]  (hidden comment: Thick Film)
R52#1  value 10K  [RESC1005N]  (hidden comment: Thick Film)
R53#1  value 10K  [RESC1005N]  (hidden comment: Thick Film)
R54#1  value 270R  [RESC1005N]  (hidden comment: Thick Film)
R55#1  value 270R  [RESC1005N]  (hidden comment: Thick Film)
R56#1  value 270R  [RESC1005N]  (hidden comment: Thick Film)
R57#1  value 5K  [RESC1005N]  (hidden comment: Thick Film)
R58#1  value 270R  [RESC1005N]  (hidden comment: Thick Film)
R59#1  value 270R  [RESC1005N]  (hidden comment: Thick Film)
SD1  MicroSD Slot  [MICROSD Slot]
U5  AT45DB081D-SU  [SOIJ-SM8_N]
U6  24LC64  [SOIJ-SM8_N]

### Nets
3V3: C36#2.1 C37#2.1 C38#2.1 C39#2.2 R45.1 R46.1 R47.2 R48.2 R49.2 R50.2 R52#1.1 R53#1.1 SD1.4(VDD) U5.6(VCC) U6.8(VCC)
GND: C36#2.2 C37#2.2 C38#2.2 C39#2.1 P7.1 P7.2 R57#1.2 SD1.6(VSS) SD1.10(G1) SD1.11(G2) SD1.12(G3) SD1.13(G4) U5.7(GND) U6.1(A0) U6.2(A1) U6.3(A2) U6.4(VSS) U6.7(WP)
FLASH_SSEL: R52#1.2 U5.4(CS#)
I2C_SCL: R45.2 U6.6(SCL)
I2C_SDA: R46.2 U6.5(SDA)
RESET: U5.3(RESET#) U5.5(WP#)
SD_DETECT: R54#1.2
SD_SSEL: R59#1.2  [project net P0[6]]
SPI_MISO: R51#1.1 R58#1.2  [project net P0[8]]
SPI_MOSI: R53#1.2 R56#1.2 U5.1(SI)  [project net P0[9]]
SPI_SCK: R55#1.2 R57#1.1 U5.2(SCK)  [project net P0[7]]
NetR47_1: R47.1 R59#1.1 SD1.2(CS/CD/DAT3)
NetR48_1: R48.1 R56#1.1 SD1.3(DI/CMD)
NetR49_1: R49.1 R55#1.1 SD1.5(SCLK/CLK)
NetR50_1: R50.1 R54#1.1 SD1.9(SD_DETECT)
NetR51#1_2: R51#1.2 U5.8(SO)
NetR58#1_1: R58#1.1 SD1.7(DO/DAT0)

Not connected (* = marked no-connect by the designer): SD1 1(NC/DAT2) 8(NC/DAT1)

### Notes on the sheet
- I2C-E2PROM
- MMC/SD Memory Card Interface
- Title
- Name
- Size:
- Revision:
- A3
- Date:
- Time:
- Sheet
- of

### Library data of the parts
C36#2 C38#2 C39#2 = CAPC_100n_0805: as C27#1 on sheet LPC1769; Package / Case: 0805 (2012 metric); Supplier 1: Digi-Key; Supplier Part Number 1: 399-1170-1-ND
C37#2 = CAPT_1u_0805_10V: Capacitor SMD Tantalum 1uF 20% 10V 0805; Manufacturer 1: AVX Corporation; Manufacturer Part Number 1: TAJP106M010RNJ; Manufacturer Size Code: P; Tolerance: ?0%; ESR (Equivalent Series Resistance): 6.000 Ohm; Type: Molded; Operating Tem: -55蚓 ~ 125蚓; Package / Case: 0805 (2012 metric); Material: Tantalum; Supplier 1: Digi-Key; Supplier Part Number 1: 478-3281-1-ND; Size / Dimension: 0.081" L x 0.053" W (2.05mm x 1.35mm); Height - Seated (Max): 0.059" (1.50mm); ComponentLink1URL: http://www.avx.com/docs/Catalogs/tajlp.pdf; ComponentLink1Description: http://www.avx.com/docs/Catalogs/tajlp.pdf
P7 = Header 2: Header, 2-Pin; LatestRevisionDate: 17-Jul-2002; LatestRevisionNote: Re-released for DXP Platform.; Publisher: Altium Limited
R45-R50 R51#1 R52#1 R53#1 R54#1 R55#1 R56#1 R57#1 R58#1 R59#1 = RES_330R_0402_5%: as R37 on sheet LPC1769; Package / Case: 0402 (1005 Metric); Supplier 1: Digi-Key; Supplier Part Number 1: 311-330JRCT-ND; ComponentLink1URL: http://www.yageo.com/documents/recent/PYu-RC0402_51_RoHS_L_6.pdf; ComponentLink1Description: http://www.yageo.com/documents/recent/PYu-RC0402_51_RoHS_L_6.pdf

## Sheet USB.SchDoc: Motor Vibration
size A4; Organization: NTUST EE-305; Address1: No.43, Sec. 4, Keelung Rd.; Address2: Da’an Dist.; Address3: Taipei 106; Address4: Taiwan (R.O.C.); DocumentNumber: 1; Revision: 3.0; SheetNumber: 6; SheetTotal: 9
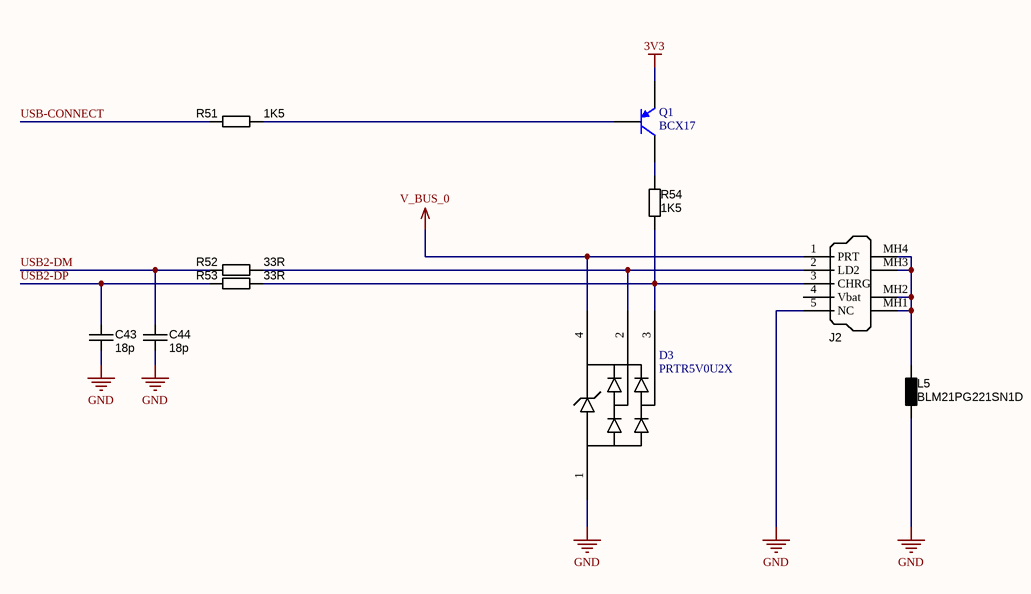
[diagram p5: USB.SchDoc]

### Parts
(Parts that share a designator on the sheet are numbered #1, #2 ... from top to bottom, then left to right.)
C43  18p  [CAPC1005N]
C44  18p  [CAPC1005N]
D3  PRTR5V0U2X  [SOT190P230X120-4N]
J2  USB_Micro  [USB_micro]  (value not drawn)
L5  BLM21PG221SN1D  [INDC2012N]
Q1  BCX17  [SOT23-3N]
R51#2  1K5  [RESC1005N]
R52#2  33R  [RESC1005N]
R53#2  33R  [RESC1005N]
R54#2  1K5  [RESC1005N]

### Nets
3V3: Q1.2(E)
GND: C43.2 C44.2 D3.1(GND) J2.5(NC) L5.1
V_BUS_0: D3.4(VCC) J2.1(PRT)
USB2-DM: C44.1 R52#2.1
USB2-DP: C43.1 R53#2.1
USB-CONNECT: R51#2.1  [project net P2[9]]
NetD3_2: D3.2(I/O_1) J2.2(LD2) R52#2.2
NetD3_3: D3.3(I/O_2) J2.3(CHRG) R53#2.2 R54#2.2
NetJ2_MH1: J2.MH1(Shell) J2.MH2(Shell) J2.MH3(Shell) J2.MH4(Shell) L5.2
NetQ1_1: Q1.1(B) R51#2.2
NetQ1_3: Q1.3(C) R54#2.1

Not connected (* = marked no-connect by the designer): J2 4(Vbat)

### Notes on the sheet
- Title
- Name
- Size:
- Revision:
- A4
- Date:
- Time:
- Sheet
- of

### Library data of the parts
C43 C44 = Capacitor SMD Cer NPO: as C15 on sheet Ethernet; Package / Case: 0805 (2012 metric); Supplier 1: Digi-Key; Supplier Part Number 1: 399-1170-1-ND; Value: 18p
J2 = USB_Micro: Connector SMD USB Type Micro
L5 = BLM21PG221SN1D: as L2 on sheet Ethernet; Supplier 1: Digi-Key; Supplier Part Number 1: 490-1054-1-ND
Q1 = BCX17: PNP General Purpose Transistors; Published: 8-Jun-2000; LatestRevisionDate: 15-Jan-2003; LatestRevisionNote: PCB Footprint 'BCY-W3/D4.7' replaced; DatasheetVersion: 1997; PackageVersion: Sep-1998; PackageReference: TO-92A; Publisher: Altium Limited; PackageDescription: TO, Flat Index; 3 In-Line, Axial Leads; Body Dia. 4.5mm; Leads 0.51 x 0.48 mm (max); ComponentLink1Description: Manufacturer Link; ComponentLink1URL: http://www.fairchildsemi.com/; ComponentLink2Description: Datasheet; ComponentLink2URL: http://www.fairchildsemi.com/ds/2N%2F2N3906.pdf
R51#2 R52#2 R53#2 R54#2 = Resistor SMD chip: as R3 on sheet Ethernet; Package / Case: 0805 (2012 metric); Material: Thick Film; Supplier 1: Digi-Key; Supplier Part Number 1: 311-10KARCT-ND
  R51#2 R54#2: Value: 1K5
  R52#2 R53#2: Value: 33R

## Sheet Analog Input.SchDoc: Motor Vibration
size A4; Organization: NTUST EE-305; Address1: No.43, Sec. 4, Keelung Rd.; Address2: Da’an Dist.; Address3: Taipei 106; Address4: Taiwan (R.O.C.); DocumentNumber: 1; Revision: 3.0; SheetNumber: 7; SheetTotal: 9
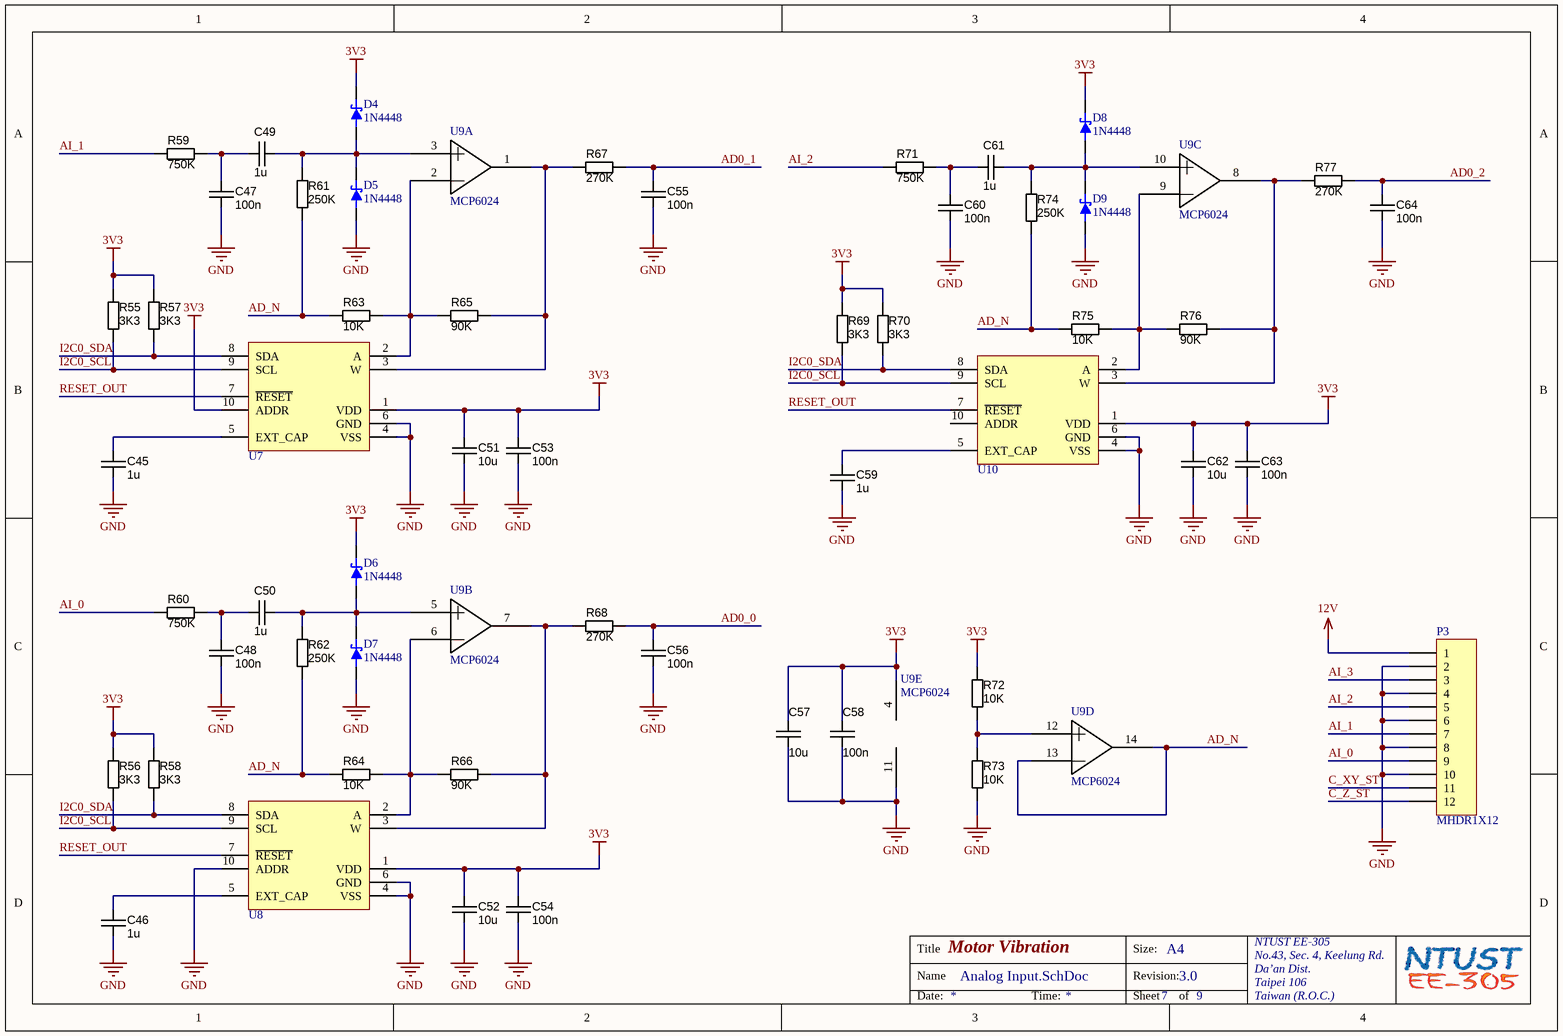
[diagram p6: Analog Input.SchDoc]

### Parts
(Parts that share a designator on the sheet are numbered #1, #2 ... from top to bottom, then left to right.)
C45  1u  [CAPC1608N]
C46  1u  [CAPC1608N]
C47  100n  [CAPC1005N]
C48  100n  [CAPC1005N]
C49  1u  [CAPC1608N]
C50  1u  [CAPC1608N]
C51  10u  [CAPC2012N]
C52  10u  [CAPC2012N]
C53  100n  [CAPC1005N]
C54  100n  [CAPC1005N]
C55  100n  [CAPC1005N]
C56  100n  [CAPC1005N]
C57  10u  [CAPC2012N]
C58  100n  [CAPC1005N]
C59  1u  [CAPC1608N]
C60  100n  [CAPC1005N]
C61  1u  [CAPC1608N]
C62  10u  [CAPC2012N]
C63  100n  [CAPC1005N]
C64  100n  [CAPC1005N]
D4  1N4448  [SOD323]
D5  1N4448  [SOD323]
D6  1N4448  [SOD323]
D7  1N4448  [SOD323]
D8  1N4448  [SOD323]
D9  1N4448  [SOD323]
P3#2  MHDR1X12  [MHDR1X12]
R55#2  3K3  [RESC1005N]
R56#2  3K3  [RESC1005N]
R57#2  3K3  [RESC1005N]
R58#2  3K3  [RESC1005N]
R59#2  750K  [RESC1005N]
R60  750K  [RESC1005N]
R61  250K  [RESC1005N]
R62  250K  [RESC1005N]
R63  10K  [RESC1005N]
R64  10K  [RESC1005N]
R65  90K  [RESC1005N]
R66  90K  [RESC1005N]
R67  270K  [RESC1005N]
R68  270K  [RESC1005N]
R69  3K3  [RESC1005N]
R70  3K3  [RESC1005N]
R71  750K  [RESC1005N]
R72  10K  [RESC1005N]
R73  10K  [RESC1005N]
R74  250K  [RESC1005N]
R75  10K  [RESC1005N]
R76  90K  [RESC1005N]
R77  270K  [RESC1005N]
U7  100k  [MSOP-UN10_L]  (value not drawn)
U8#2  100k  [MSOP-UN10_L]  (value not drawn)
U9  MCP6024  [MCHP-TSSOP-ST14_L]  (parts A,B,C,D,E of 5)
U10  100k  [MSOP-UN10_L]  (value not drawn)

### Nets
3V3: C51.1 C52.1 C53.1 C54.1 C57.1 C58.1 C62.1 C63.1 D4.1(cathode) D6.1(cathode) D8.1(cathode) R55#2.1 R56#2.1 R57#2.1 R58#2.1 R69.1 R70.1 R72.1 U7.1(VDD) U7.10(ADDR) U8#2.1(VDD) U9.4(VDD) U10.1(VDD)
12V: P3#2.1
GND: C45.2 C46.2 C47.2 C48.2 C51.2 C52.2 C53.2 C54.2 C55.2 C56.2 C57.2 C58.2 C59.2 C60.2 C62.2 C63.2 C64.2 D5.2(anode) D7.2(anode) D9.2(anode) P3#2.2 P3#2.4 P3#2.6 P3#2.8 P3#2.10 R73.2 U7.4(VSS) U7.6(GND) U8#2.4(VSS) U8#2.6(GND) U8#2.10(ADDR) U9.11(GND) U10.4(VSS) U10.6(GND)
AD0_0: C56.1 R68.2
AD0_1: C55.1 R67.2
AD0_2: C64.1 R77.2
AD_N: R61.2 R62.2 R63.1 R64.1 R74.2 R75.1 U9.13(VIND-) U9.14(VOUTD)
AI_0: P3#2.9 R60.1
AI_1: P3#2.7 R59#2.1
AI_2: P3#2.5 R71.1
AI_3: P3#2.3
C_XY_ST: P3#2.11
C_Z_ST: P3#2.12
I2C0_SCL: R55#2.2 R56#2.2 R69.2 U7.9(SCL) U8#2.9(SCL) U10.9(SCL)
I2C0_SDA: R57#2.2 R58#2.2 R70.2 U7.8(SDA) U8#2.8(SDA) U10.8(SDA)
RESET_OUT: U7.7(~{RESET}) U8#2.7(~{RESET}) U10.7(~{RESET})
NetC45_1: C45.1 U7.5(EXT_CAP)
NetC46_1: C46.1 U8#2.5(EXT_CAP)
NetC47_1: C47.1 C49.1 R59#2.2
NetC48_1: C48.1 C50.1 R60.2
NetC49_2: C49.2 D4.2(anode) D5.1(cathode) R61.1 U9.3(VINA+)
NetC50_2: C50.2 D6.2(anode) D7.1(cathode) R62.1 U9.5(VINB+)
NetC59_1: C59.1 U10.5(EXT_CAP)
NetC60_1: C60.1 C61.1 R71.2
NetC61_2: C61.2 D8.2(anode) D9.1(cathode) R74.1 U9.10(VINC+)
NetR63_2: R63.2 R65.1 U7.2(A) U9.2(VINA-)
NetR64_2: R64.2 R66.1 U8#2.2(A) U9.6(VINB-)
NetR65_2: R65.2 R67.1 U7.3(W) U9.1(VOUTA)
NetR66_2: R66.2 R68.1 U8#2.3(W) U9.7(VOUTB)
NetR72_2: R72.2 R73.1 U9.12(VIND+)
NetR75_2: R75.2 R76.1 U9.9(VINC-) U10.2(A)
NetR76_2: R76.2 R77.1 U9.8(VOUTC) U10.3(W)

Not connected (* = marked no-connect by the designer): U10 10(ADDR)

### Notes on the sheet
- Title
- Name
- Size:
- Revision:
- A4
- Date:
- Time:
- Sheet
- of

### Library data of the parts
C45 C46 C49-C52 C57 C59 C61 C62 = Capacitor SMD Cer X5R: as C39#1 on sheet Power supply; Package / Case: 0805 (2012 metric); Supplier 1: Digi-Key; Supplier Part Number 1: 399-1170-1-ND
  C45 C46 C49 C50 C59 C61: Value: 1u
  C51 C52 C57 C62: Value: 10u
C47 C48 C53-C56 C58 C60 C63 C64 = Capacitor SMD Cer X7R: as C13 on sheet Ethernet; Package / Case: 0805 (2012 metric); Supplier 1: Digi-Key; Supplier Part Number 1: 399-1170-1-ND; Value: 100n
D4-D9 = 1N4448: SURFACE MOUNT FAST SWITCHING DIODE; Supplier 1: Digi-Key; Supplier Part Number 1: 1N4448HWS-FDICT-ND
P3#2 = MHDR1X12: Header, 12-Pin; LatestRevisionDate: 17-Jul-2002; LatestRevisionNote: Re-released for DXP Platform.; Publisher: Altium Limited
R55#2 R56#2 R57#2 R58#2 R59#2 R60-R77 = Resistor SMD chip: as R3 on sheet Ethernet; Package / Case: 0805 (2012 metric); Material: Thick Film; Supplier 1: Digi-Key; Supplier Part Number 1: 311-10KARCT-ND
  R55#2 R56#2 R57#2 R58#2 R69 R70: Value: 3K3
  R59#2 R60 R71: Value: 750K
  R61 R62 R74: Value: 250K
  R63 R64 R72 R73 R75: Value: 10K
  R65 R66 R76: Value: 90K
  R67 R68 R77: Value: 270K
U7 U8#2 U10 = AD5272: 1024-/256-Position, 1% Resistor Tolerance Error,   I2C Interface and 50-TP Memory Digital Rheostat; Value: 100k; Supplier 1: Digi-Key; Supplier Part Number 1: AD5272BRMZ-100-ND
U9 = MCP6024: Rail-to-Rail Input/Output, 10 MHz Op Amps; Supplier 1: Digi-Key; Supplier Part Number 1: MCP6024-E/ST-ND

## Sheet Expansion connectors.SchDoc: Motor Vibration
size A4; Organization: NTUST EE-305; Address1: No.43, Sec. 4, Keelung Rd.; Address2: Da’an Dist.; Address3: Taipei 106; Address4: Taiwan (R.O.C.); DocumentNumber: 1; Revision: 3.0; SheetNumber: 8; SheetTotal: 9
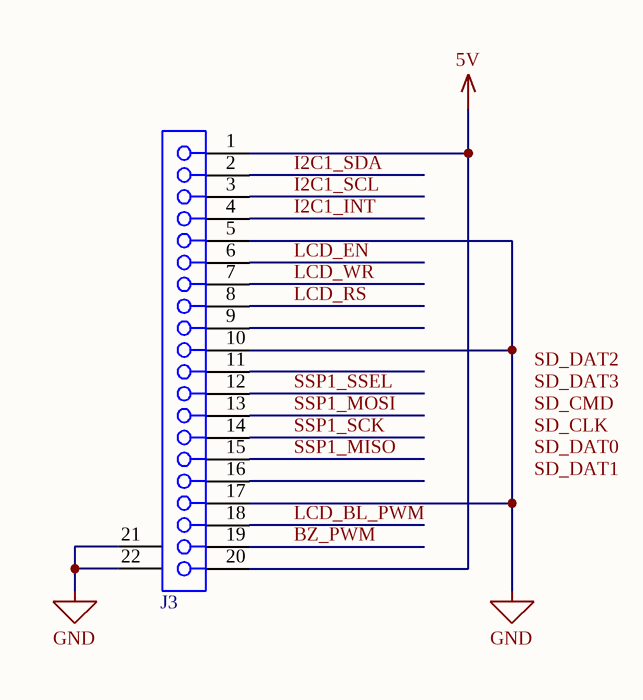
[diagram p7: Expansion connectors.SchDoc]

### Parts
(Parts that share a designator on the sheet are numbered #1, #2 ... from top to bottom, then left to right.)
J3#2  FFC 20P 0.5mm  [FPC_20P_0.5mm]  (value not drawn)

### Nets
5V: J3#2.1 J3#2.20
GND: J3#2.5 J3#2.10 J3#2.17 J3#2.21(MH1) J3#2.22(MH2)
BZ_PWM: J3#2.19
I2C1_INT: J3#2.4
I2C1_SCL: J3#2.3
I2C1_SDA: J3#2.2
LCD_BL_PWM: J3#2.18
LCD_EN: J3#2.6
LCD_RS: J3#2.8
LCD_WR: J3#2.7
SSP1_MISO: J3#2.15
SSP1_MOSI: J3#2.13
SSP1_SCK: J3#2.14
SSP1_SSEL: J3#2.12

Not connected (* = marked no-connect by the designer): J3#2 9 11 16

### Notes on the sheet
- Labels drawn without touching a wire or pin: SD_CLK, SD_CMD, SD_DAT0, SD_DAT1, SD_DAT2, SD_DAT3
- Title
- Name
- Size:
- Revision:
- A4
- Date:
- Time:
- Sheet
- of

### Library data of the parts
J3#2 = Molex,-LLC 5051102091: CONN FFC/FPC BOTTOM 20P .5MM R/A; Supplier 1: Digi-Key; Supplier Part Number 1: WM11287CT-ND

## Sheet Accelerometer.SchDoc: Motor Vibration
size A4; Organization: NTUST EE-305; Address1: No.43, Sec. 4, Keelung Rd.; Address2: Da’an Dist.; Address3: Taipei 106; Address4: Taiwan (R.O.C.); DocumentNumber: 2; Revision: 3.0; SheetNumber: 9; SheetTotal: 9
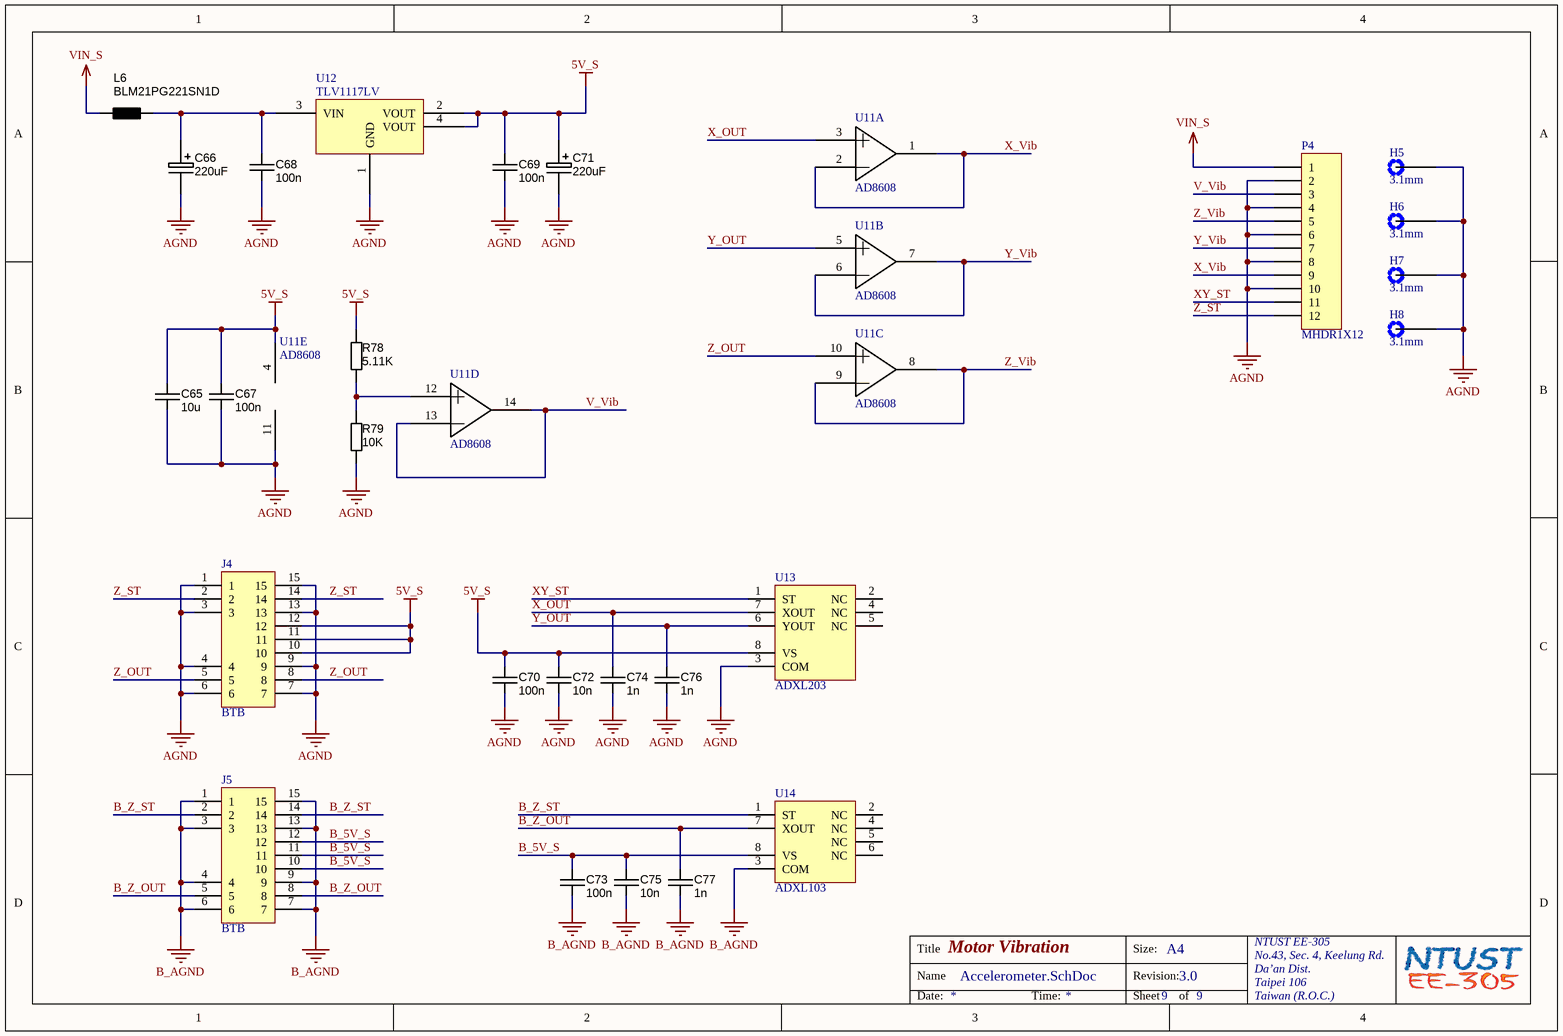
[diagram p8: Accelerometer.SchDoc]

### Parts
(Parts that share a designator on the sheet are numbered #1, #2 ... from top to bottom, then left to right.)
C65  10u  [CAPC1005N]
C66  220uF  [CAP_ELEC_SIZE_D8]
C67  100n  [CAPC1005N]
C68  100n  [CAPC1005N]
C69  100n  [CAPC1005N]
C70  100n  [CAPC1005N]
C71  220uF  [CAP_ELEC_SIZE_D8]
C72  10n  [CAPC1005N]
C73  100n  [CAPC1005N]
C74  1n  [CAPC1005N]
C75  10n  [CAPC1005N]
C76  1n  [CAPC1005N]
C77  1n  [CAPC1005N]
H5  3.1mm  [Holes]
H6  3.1mm  [Holes]
H7  3.1mm  [Holes]
H8  3.1mm  [Holes]
J4  BTB  [BTB_B]
J5  BTB  [BTB_S]
L6  BLM21PG221SN1D  [INDC2012N]
P4#2  MHDR1X12  [MHDR1X12]
R78  5.11K  [RESC1005N]
R79  10K  [RESC1005N]
U11  AD8608  [MCHP-TSSOP-ST14_L]  (parts A,B,C,D,E of 5)
U12  TLV1117LV  [SOT-223-DB3_N]
U13  ADXL203  [LCC8-E-8-1]
U14  ADXL103  [LCC8-E-8-1]

### Nets
5V_S: C65.1 C67.1 C69.1 C70.1 C71.1 C72.1 J4.10 J4.11 J4.12 R78.1 U11.4(VDD) U12.2(VOUT) U12.4(VOUT) U13.8(VS)
AGND: C65.2 C66.2 C67.2 C68.2 C69.2 C70.2 C71.2 C72.2 C74.2 C76.2 H5.0 H6.0 H7.0 H8.0 J4.1 J4.3 J4.4 J4.6 J4.7 J4.9 J4.13 J4.15 P4#2.2 P4#2.4 P4#2.6 P4#2.8 P4#2.10 R79.2 U11.11(GND) U12.1(GND) U13.3(COM)
B_AGND: C73.2 C75.2 C77.2 J5.1 J5.3 J5.4 J5.6 J5.7 J5.9 J5.13 J5.15 U14.3(COM)
VIN_S: L6.1 P4#2.1
B_5V_S: C73.1 C75.1 J5.10 J5.11 J5.12 U14.8(VS)
B_Z_OUT: C77.1 J5.5 J5.8 U14.7(XOUT)
B_Z_ST: J5.2 J5.14 U14.1(ST)
V_Vib: P4#2.3 U11.13(VIND-) U11.14(VOUTD)
X_OUT: C74.1 U11.3(VINA+) U13.7(XOUT)
X_Vib: P4#2.9 U11.1(VOUTA) U11.2(VINA-)
XY_ST: P4#2.11 U13.1(ST)
Y_OUT: C76.1 U11.5(VINB+) U13.6(YOUT)
Y_Vib: P4#2.7 U11.6(VINB-) U11.7(VOUTB)
Z_OUT: J4.5 J4.8 U11.10(VINC+)
Z_ST: J4.2 J4.14 P4#2.12
Z_Vib: P4#2.5 U11.8(VOUTC) U11.9(VINC-)
NetC66_1: C66.1 C68.1 L6.2 U12.3(VIN)
NetR78_2: R78.2 R79.1 U11.12(VIND+)

Not connected (* = marked no-connect by the designer): U13 2(NC) 4(NC) 5(NC); U14 2(NC) 4(NC) 5(NC) 6(NC)

### Notes on the sheet
- Title
- Name
- Size:
- Revision:
- A4
- Date:
- Time:
- Sheet
- of

### Library data of the parts
C65 = Capacitor SMD Cer X5R: as C39#1 on sheet Power supply; Package / Case: 0805 (2012 metric); Supplier 1: Digi-Key; Supplier Part Number 1: 399-1170-1-ND; Value: 10u
C66 C71 = Capacitor SMD Alum Elec: as C32#2 on sheet Power supply; Package / Case: Radial - Surface Mount; Supplier 1: Digi-Key; Supplier Part Number 1: PCE4185CT-ND; Value: 220uF
C67-C70 C72 C73 C75 = Capacitor SMD Cer X7R: as C13 on sheet Ethernet; Package / Case: 0805 (2012 metric); Supplier 1: Digi-Key; Supplier Part Number 1: 399-1170-1-ND
  C67-C70 C73: Value: 100n
  C72 C75: Value: 10n
C74 C76 C77 = Capacitor SMD Cer NPO: as C15 on sheet Ethernet; Package / Case: 0805 (2012 metric); Supplier 1: Digi-Key; Supplier Part Number 1: 399-1170-1-ND; Value: 1n
H5-H8 = Holes: Mounting Holes
L6 = BLM21PG221SN1D: as L2 on sheet Ethernet; Supplier 1: Digi-Key; Supplier Part Number 1: 490-1054-1-ND
P4#2 = MHDR1X12: Header, 12-Pin; LatestRevisionDate: 17-Jul-2002; LatestRevisionNote: Re-released for DXP Platform.; Publisher: Altium Limited
R78 R79 = Resistor SMD chip: as R3 on sheet Ethernet; Package / Case: 0805 (2012 metric); Material: Thick Film; Supplier 1: Digi-Key; Supplier Part Number 1: 311-10KARCT-ND
  R78: Value: 5.11K
  R79: Value: 10K
U11 = AD8608: General Purpose Amplifier 4 Circuit Rail-to-Rail 14-TSSOP; Supplier 1: Digi-Key; Supplier 2: Digi-Key; Supplier 3: Digi-Key; Supplier 4: Digi-Key; Supplier Part Number 1: AD8608ARUZ-REELTR-ND; Supplier Part Number 2: AD8608ARUZ-ND; Supplier Part Number 3: AD8608ARUZ-REELDKR-ND; Supplier Part Number 4: AD8608ARUZ-REELCT-ND
U12 = TLV1117LV: as U4#2 on sheet Power supply; Supplier 1: Digi-Key; Supplier Part Number 1: 296-28778-1-ND
U13 = ADXL203: Accelerometer X, Y Axis ±1.7g 0.5Hz ~ 2.5kHz 8-LCC (5x5); Supplier 1: Digi-Key; Supplier 2: Digi-Key; Supplier 3: Digi-Key; Supplier 4: Digi-Key; Supplier Part Number 1: ADXL203CE-REELDKR-ND; Supplier Part Number 2: ADXL203CE-ND; Supplier Part Number 3: ADXL203CE-REELTR-ND; Supplier Part Number 4: ADXL203CE-REELCT-ND
U14 = ADXL103: Accelerometer X Axis ±1.7g 0.5Hz ~ 2.5kHz 8-LCC (5x5); Supplier 1: Digi-Key; Supplier 2: Digi-Key; Supplier 3: Digi-Key; Supplier 4: Digi-Key; Supplier Part Number 1: ADXL103CE-REELDKR-ND; Supplier Part Number 2: ADXL103CE-REELCT-ND; Supplier Part Number 3: ADXL103CE-ND; Supplier Part Number 4: ADXL103CE-REELTR-ND

## Nets that join several sheets
3V3: LPC1769 (21 pins), Ethernet (12 pins), Debug and Reset (7 pins), Power supply (6 pins), SPI peripherals (15 pins), USB (Q1.2), Analog Input (23 pins)
5V: Power supply (C33#2.1 C35#2.1 L3.2), Expansion connectors (J3#2.1 J3#2.20)
GND: LPC1769 (41 pins), Ethernet (27 pins), Debug and Reset (7 pins), Power supply (16 pins), SPI peripherals (18 pins), USB (5 pins), Analog Input (34 pins), Expansion connectors (5 pins)
V_BUS_0: Power supply (L3.1 L4.1), USB (D3.4 J2.1)
VBAT: LPC1769 (BT1.1 U3#1.19), Power supply (C38#1.1 C39#1.1 C40.1 D2.3)
AD0_0: LPC1769 (P2#1.2 U3#1.9), Analog Input (C56.1 R68.2)
AD0_1: LPC1769 (P3#1.2 U3#1.8), Analog Input (C55.1 R67.2)
AD0_2: LPC1769 (P4#1.2 U3#1.7), Analog Input (C64.1 R77.2)
ENET-CRS: LPC1769 (U3#1.92), Ethernet (R8.1)
ENET-MDC: LPC1769 (U3#1.87), Ethernet (U3#2.13)
ENET-MDIO: LPC1769 (U3#1.86), Ethernet (R11.2 U3#2.12)
ENET-REF_CLK: LPC1769 (U3#1.88), Ethernet (R10.1)
ENET-RX_ER: LPC1769 (U3#1.89), Ethernet (R9.1)
ENET-RXD0: LPC1769 (U3#1.91), Ethernet (R6.1)
ENET-RXD1: LPC1769 (U3#1.90), Ethernet (R7.1)
ENET-TX_EN: LPC1769 (U3#1.93), Ethernet (R5.1)
ENET-TXD0: LPC1769 (U3#1.95), Ethernet (R3.1)
ENET-TXD1: LPC1769 (U3#1.94), Ethernet (R4.1)
FLASH_SSEL: LPC1769 (U3#1.80), SPI peripherals (R52#1.2 U5.4)
I2C_SCL: LPC1769 (U3#1.58), SPI peripherals (R45.2 U6.6)
I2C_SDA: LPC1769 (U3#1.59), SPI peripherals (R46.2 U6.5)
JTAG_TCLK_SWCLK: LPC1769 (P6.4 U3#1.5), Debug and Reset (P1#2.4 R23.1)
JTAG_TDI: LPC1769 (P6.8 U3#1.2), Debug and Reset (P1#2.8 R25.2)
JTAG_TDO_SWO: LPC1769 (P6.6 U3#1.1), Debug and Reset (P1#2.6 R24.2)
JTAG_TMS_SWDIO: LPC1769 (P6.2 U3#1.3), Debug and Reset (P1#2.2 R22.2)
LCD_EN: LPC1769 (P1#1.6 U3#1.37), Expansion connectors (J3#2.6)
LCD_RS: LPC1769 (P1#1.3 U3#1.38), Expansion connectors (J3#2.8)
P0[6]: LPC1769 (U3#1.79), SPI peripherals (R59#1.2)
P0[7]: LPC1769 (U3#1.78), SPI peripherals (R55#1.2 R57#1.1 U5.2)
P0[8]: LPC1769 (U3#1.77), SPI peripherals (R51#1.1 R58#1.2)
P0[9]: LPC1769 (U3#1.76), SPI peripherals (R53#1.2 R56#1.2 U5.1)
P2[9]: LPC1769 (U3#1.64), USB (R51#2.1)
RESET: LPC1769 (LED5.K R38.1 R42.1 U3#1.17), Ethernet (U3#2.15), Debug and Reset (5 pins), SPI peripherals (U5.3 U5.5)
RESET_OUT: Debug and Reset (LED1.K), Analog Input (U7.7 U8#2.7 U10.7)